# EAGLE design V2_Flight_Controller (EAGLE 9.5.1)
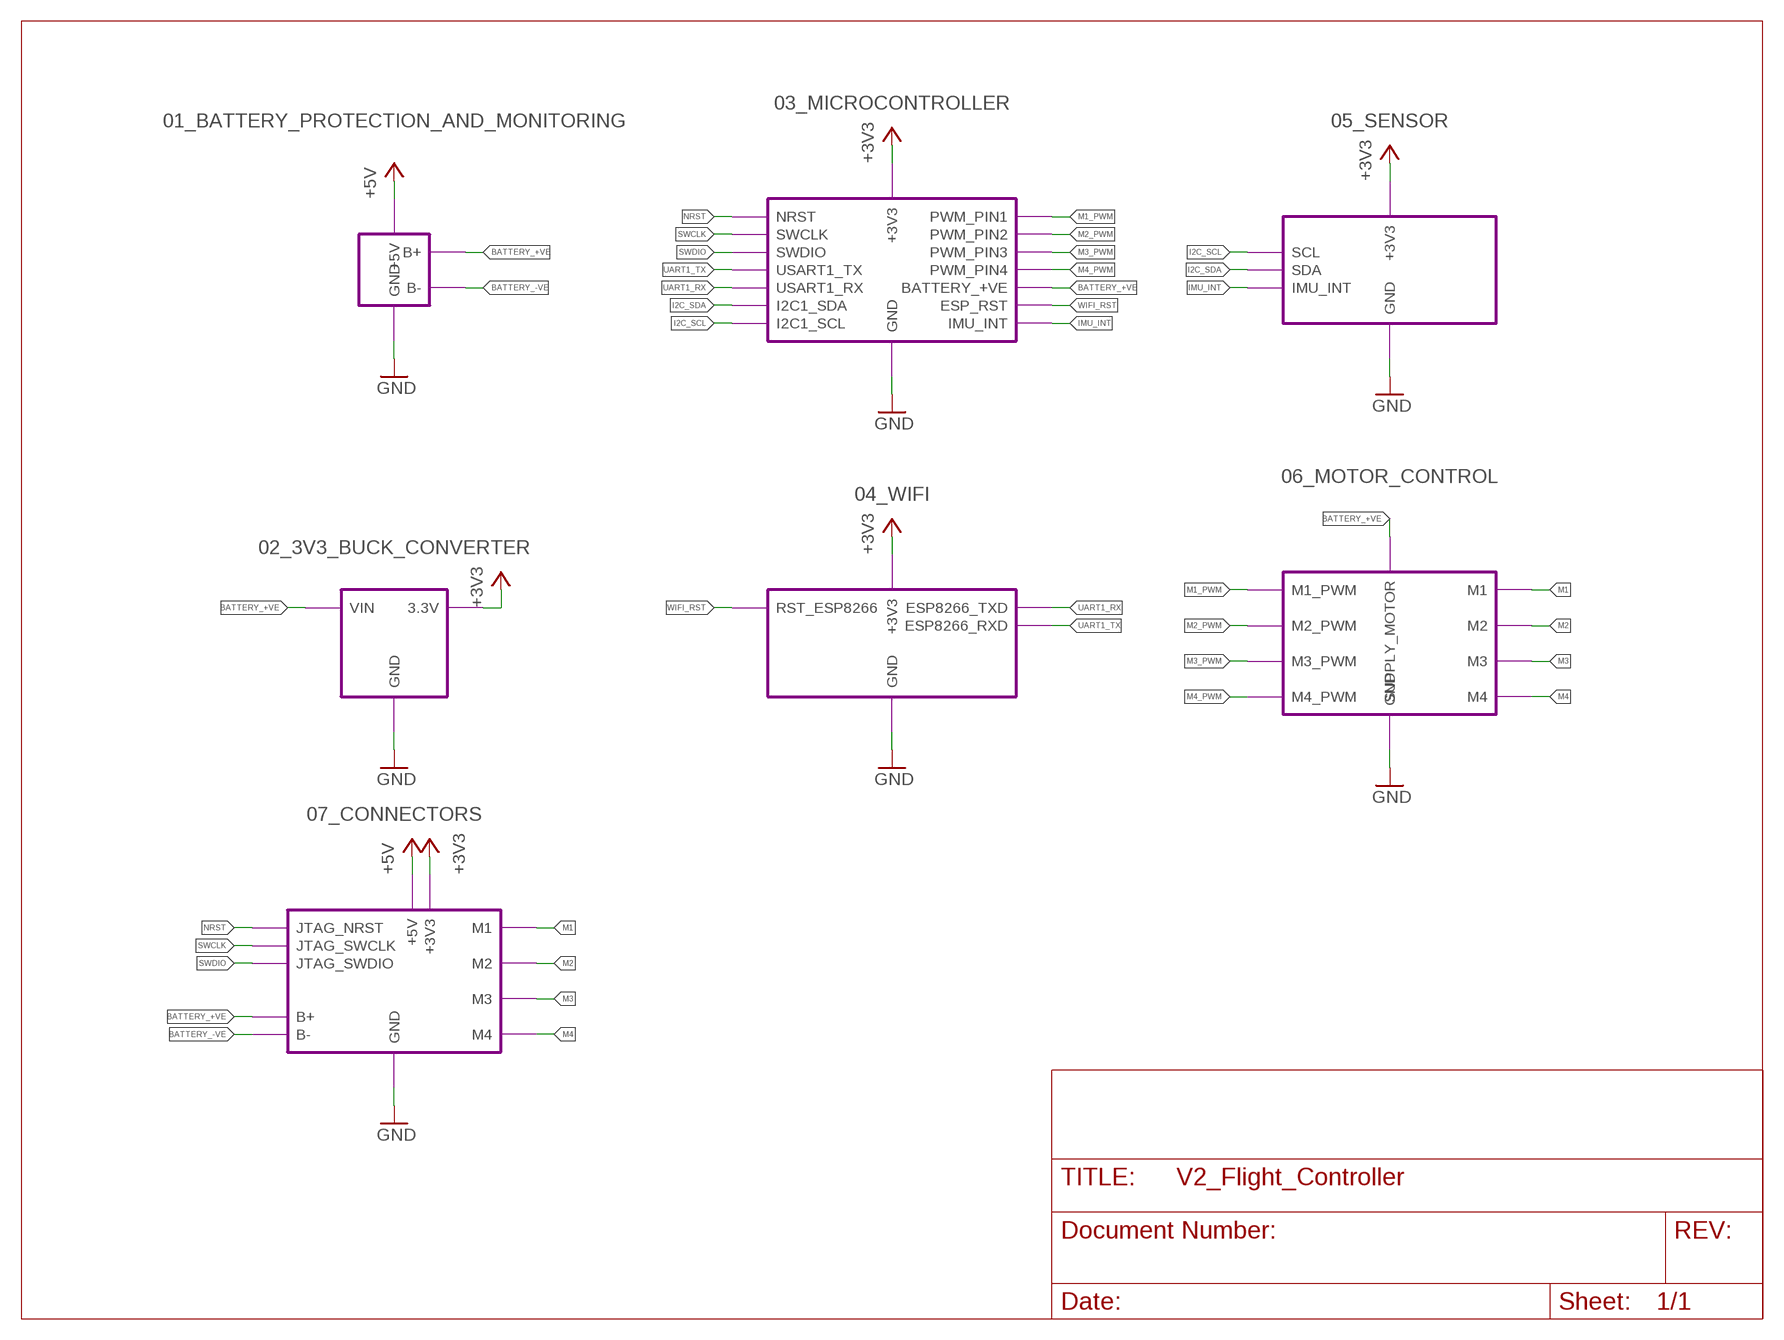
[diagram p0: schematic, sheet 1]

## Module instances
03_MICROCONTROLLER = MICROCONTROLLER
02_3V3_BUCK_CONVERTER = 3V3_BUCK_CONVERTER
01_BATTERY_PROTECTION_AND_MONITORING = BATTERY_PROTECTION_AND_MONITORING
04_WIFI = WIFI
05_SENSOR = SENSOR
06_MOTOR_CONTROL = MOTOR_CONTROL
07_CONNECTORS = CONNECTORS

## Nets
+3V3: port 07_CONNECTORS.+3V3 02_3V3_BUCK_CONVERTER.3.3V 04_WIFI.+3V3 03_MICROCONTROLLER.+3V3 05_SENSOR.+3V3
+5V: port 01_BATTERY_PROTECTION_AND_MONITORING.+5V 07_CONNECTORS.+5V
BATTERY_+VE: port 01_BATTERY_PROTECTION_AND_MONITORING.B+ 07_CONNECTORS.B+ 02_3V3_BUCK_CONVERTER.VIN 06_MOTOR_CONTROL.SUPPLY_MOTOR 03_MICROCONTROLLER.BATTERY_+VE
BATTERY_-VE: port 01_BATTERY_PROTECTION_AND_MONITORING.B- 07_CONNECTORS.B-
GND: port 01_BATTERY_PROTECTION_AND_MONITORING.GND 02_3V3_BUCK_CONVERTER.GND 04_WIFI.GND 06_MOTOR_CONTROL.GND 05_SENSOR.GND 03_MICROCONTROLLER.GND 07_CONNECTORS.GND
I2C_SCL: port 03_MICROCONTROLLER.I2C1_SCL 05_SENSOR.SCL
I2C_SDA: port 03_MICROCONTROLLER.I2C1_SDA 05_SENSOR.SDA
IMU_INT: port 03_MICROCONTROLLER.IMU_INT 05_SENSOR.IMU_INT
M1: port 07_CONNECTORS.M1 06_MOTOR_CONTROL.M1
M1_PWM: port 06_MOTOR_CONTROL.M1_PWM 03_MICROCONTROLLER.PWM_PIN1
M2: port 07_CONNECTORS.M2 06_MOTOR_CONTROL.M2
M2_PWM: port 03_MICROCONTROLLER.PWM_PIN2 06_MOTOR_CONTROL.M2_PWM
M3: port 07_CONNECTORS.M3 06_MOTOR_CONTROL.M3
M3_PWM: port 03_MICROCONTROLLER.PWM_PIN3 06_MOTOR_CONTROL.M3_PWM
M4: port 07_CONNECTORS.M4 06_MOTOR_CONTROL.M4
M4_PWM: port 03_MICROCONTROLLER.PWM_PIN4 06_MOTOR_CONTROL.M4_PWM
NRST: port 03_MICROCONTROLLER.NRST 07_CONNECTORS.JTAG_NRST
SWCLK: port 03_MICROCONTROLLER.SWCLK 07_CONNECTORS.JTAG_SWCLK
SWDIO: port 03_MICROCONTROLLER.SWDIO 07_CONNECTORS.JTAG_SWDIO
UART1_RX: port 03_MICROCONTROLLER.USART1_RX 04_WIFI.ESP8266_TXD
UART1_TX: port 03_MICROCONTROLLER.USART1_TX 04_WIFI.ESP8266_RXD
WIFI_RST: port 04_WIFI.RST_ESP8266 03_MICROCONTROLLER.ESP_RST

## Library data of the parts

## Module MICROCONTROLLER
Ports: PWM_PIN1(out) PWM_PIN2(out) PWM_PIN3(out) PWM_PIN4(out) NRST(io) SWCLK(io) SWDIO(io) I2C1_SCL(io) I2C1_SDA(io) USART1_TX(out) USART1_RX(io) IMU_INT(io) +3V3(pwr) GND(pwr) BATTERY_+VE(in) ESP_RST(out)
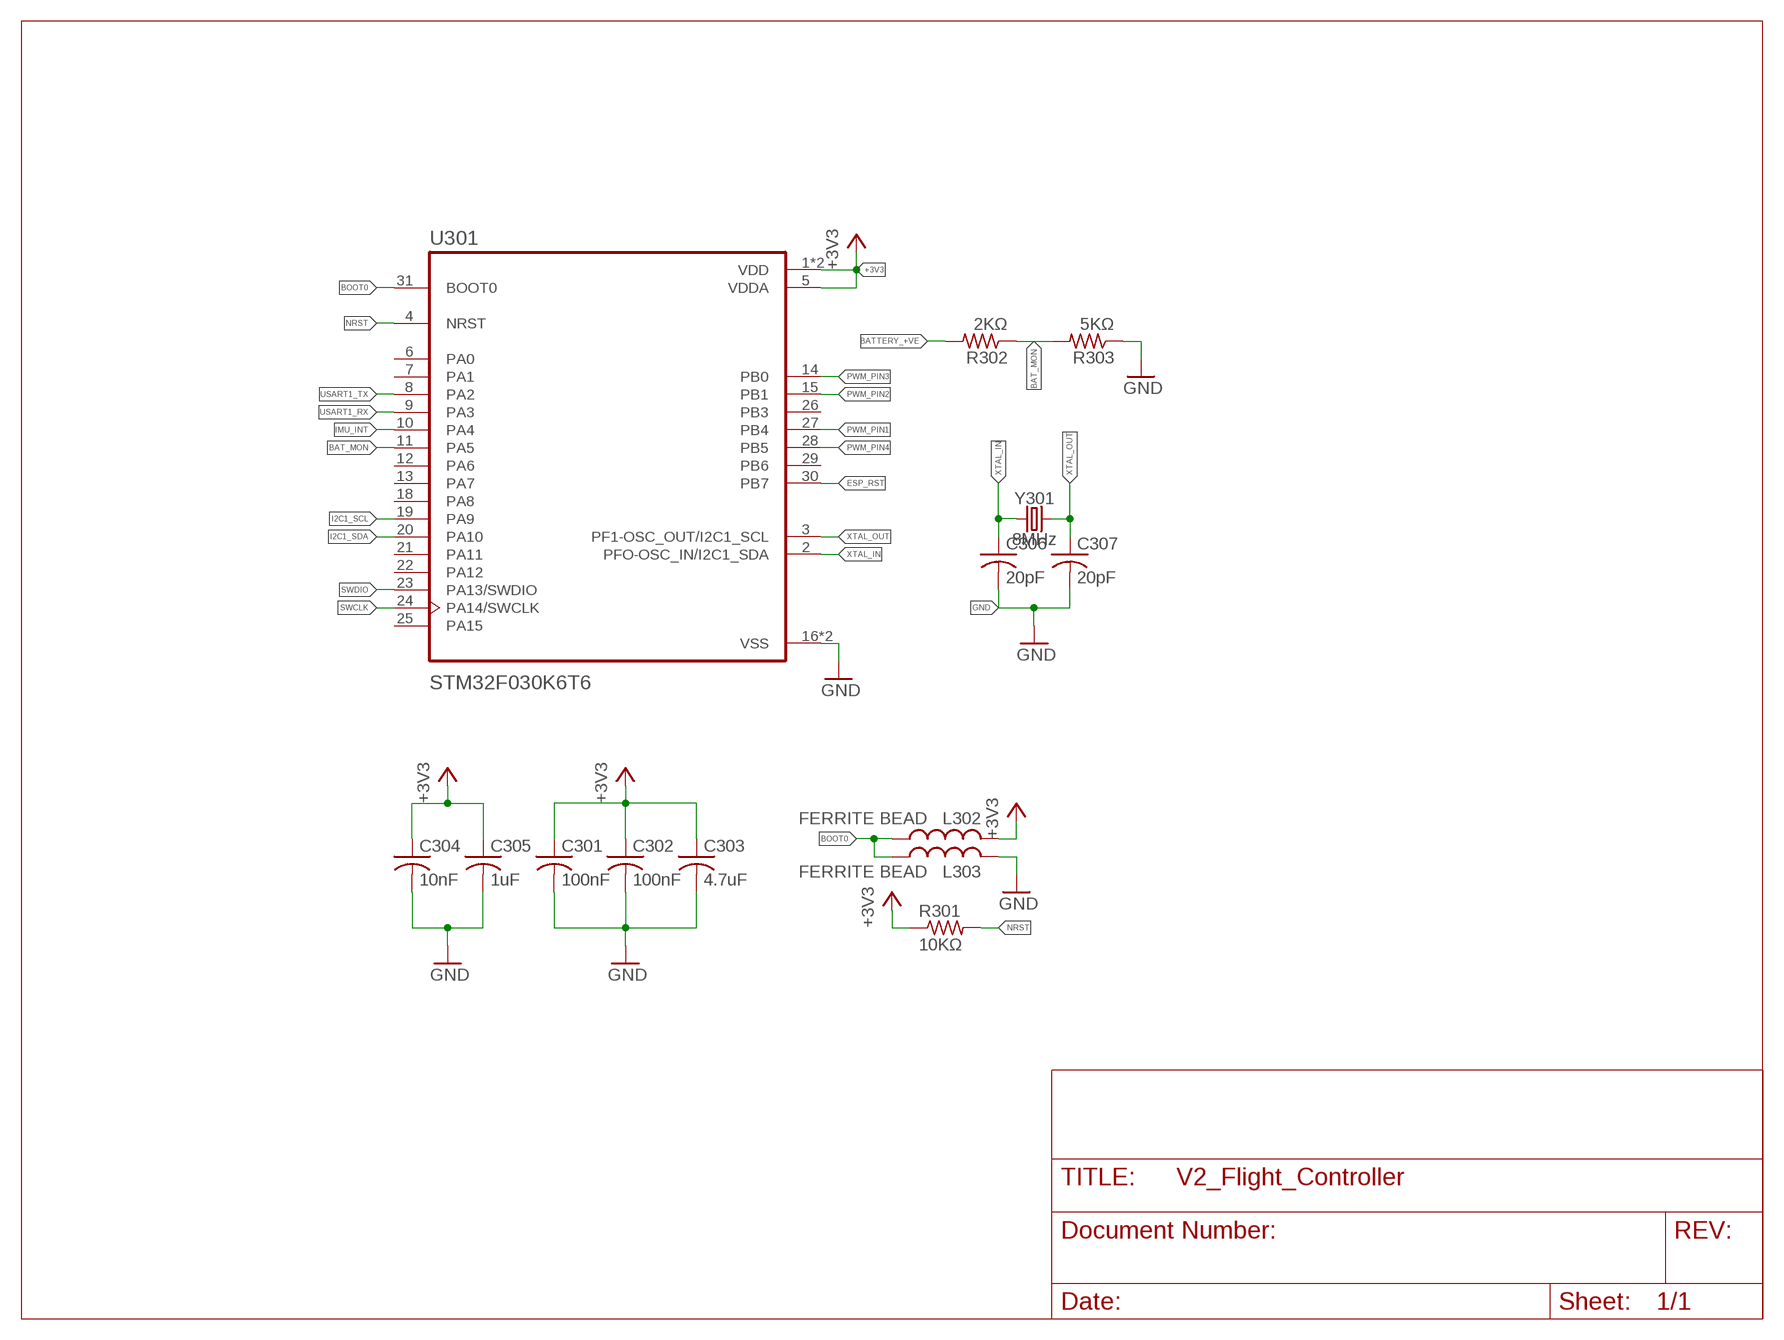
[diagram p1: schematic, module MICROCONTROLLER, sheet 1]

### Parts
C301  100nF  C-USC0603  [C0603]
C302  100nF  C-USC0603  [C0603]
C303  4.7uF  C-USC0603  [C0603]
C304  10nF  C-USC0603  [C0603]
C305  1uF  C-USC0603  [C0603]
C306  20pF  C-USC0603  [C0603]
C307  20pF  C-USC0603  [C0603]
L302  FERRITE BEAD  L-USL2012C  [L2012C]
L303  FERRITE BEAD  L-USL2012C  [L2012C]
R301  10KΩ  R-US_R0603  [R0603]
R302  2KΩ  R-US_R0603  [R0603]
R303  5KΩ  R-US_R0603  [R0603]
U301  STM32F030K6T6  [QFP80P900X900X160-32N]
Y301  8MHz  CRYSTAL-8MHZSMD-HC49UP  [HC49UP]

### Nets
+3V3: C301.1 C302.1 C303.1 C304.1 C305.1 L302.2 R301.1 U301.1(VDD) U301.5(VDDA) U301.17(VDD)
BAT_MON: R302.1 R303.2 U301.11(PA5)
BATTERY_+VE: R302.2
BOOT0: L302.1 L303.1 U301.31(BOOT0)
ESP_RST: U301.30(PB7)
GND: C301.2 C302.2 C303.2 C304.2 C305.2 C306.2 C307.2 L303.2 R303.1 U301.16(VSS) U301.32(VSS)
I2C1_SCL: U301.19(PA9)
I2C1_SDA: U301.20(PA10)
IMU_INT: U301.10(PA4)
NRST: R301.2 U301.4(NRST)
PWM_PIN1: U301.27(PB4)
PWM_PIN2: U301.15(PB1)
PWM_PIN3: U301.14(PB0)
PWM_PIN4: U301.28(PB5)
SWCLK: U301.24(PA14/SWCLK)
SWDIO: U301.23(PA13/SWDIO)
USART1_RX: U301.9(PA3)
USART1_TX: U301.8(PA2)
XTAL_IN: C306.1 U301.2(PFO-OSC_IN/I2C1_SDA) Y301.1
XTAL_OUT: C307.1 U301.3(PF1-OSC_OUT/I2C1_SCL) Y301.2
Unconnected: U301.6(PA0) U301.7(PA1) U301.12(PA6) U301.13(PA7) U301.18(PA8) U301.21(PA11) U301.22(PA12) U301.25(PA15) U301.26(PB3) U301.29(PB6)

### Library data of the parts
C301-C307 = adafruit:C-US: CAPACITOR, American symbol
L302 L303 = rcl:L-US: INDUCTOR, American symbol; SPICEPREFIX: L
R301-R303 = adafruit:R-US_: RESISTOR, American symbol
U301 = STM32F030K6T6:STM32F030K6T6: None; AVAILABILITY: Unavailable; DESCRIPTION: MCU 32-Bit STM32F ARM Cortex M0 RISC 32KB Flash 2.5V/3.3V 32-Pin LQFP Tray; MF: STMicroelectronics; MP: STM32F030K6T6; PACKAGE: LQFP-32 STMicroelectronics; PRICE: None
Y301 = SparkFun-Clocks:CRYSTAL-8MHZ: 8MHz Crystal Datasheet Example <http://www.futureelectronics.com/en/technologies/electromechanical/timing-devices/crystals/Pages/6008189-ABM3B-8.000MHZ-B2-T.aspx?IM=0> Frequency: 8MHz Frequency Tolerance: ±20ppm Load Capacitance: 18pF SparkFun Products: Pro Micro -3.3V/8MHz <https://www.sparkfun.com/products/12587> WAV Trigger <https://www.sparkfun.com/products/13660>; PROD_ID: XTAL-11706

## Module 3V3_BUCK_CONVERTER
Ports: VIN(pwr) 3.3V(pwr) GND(pwr)
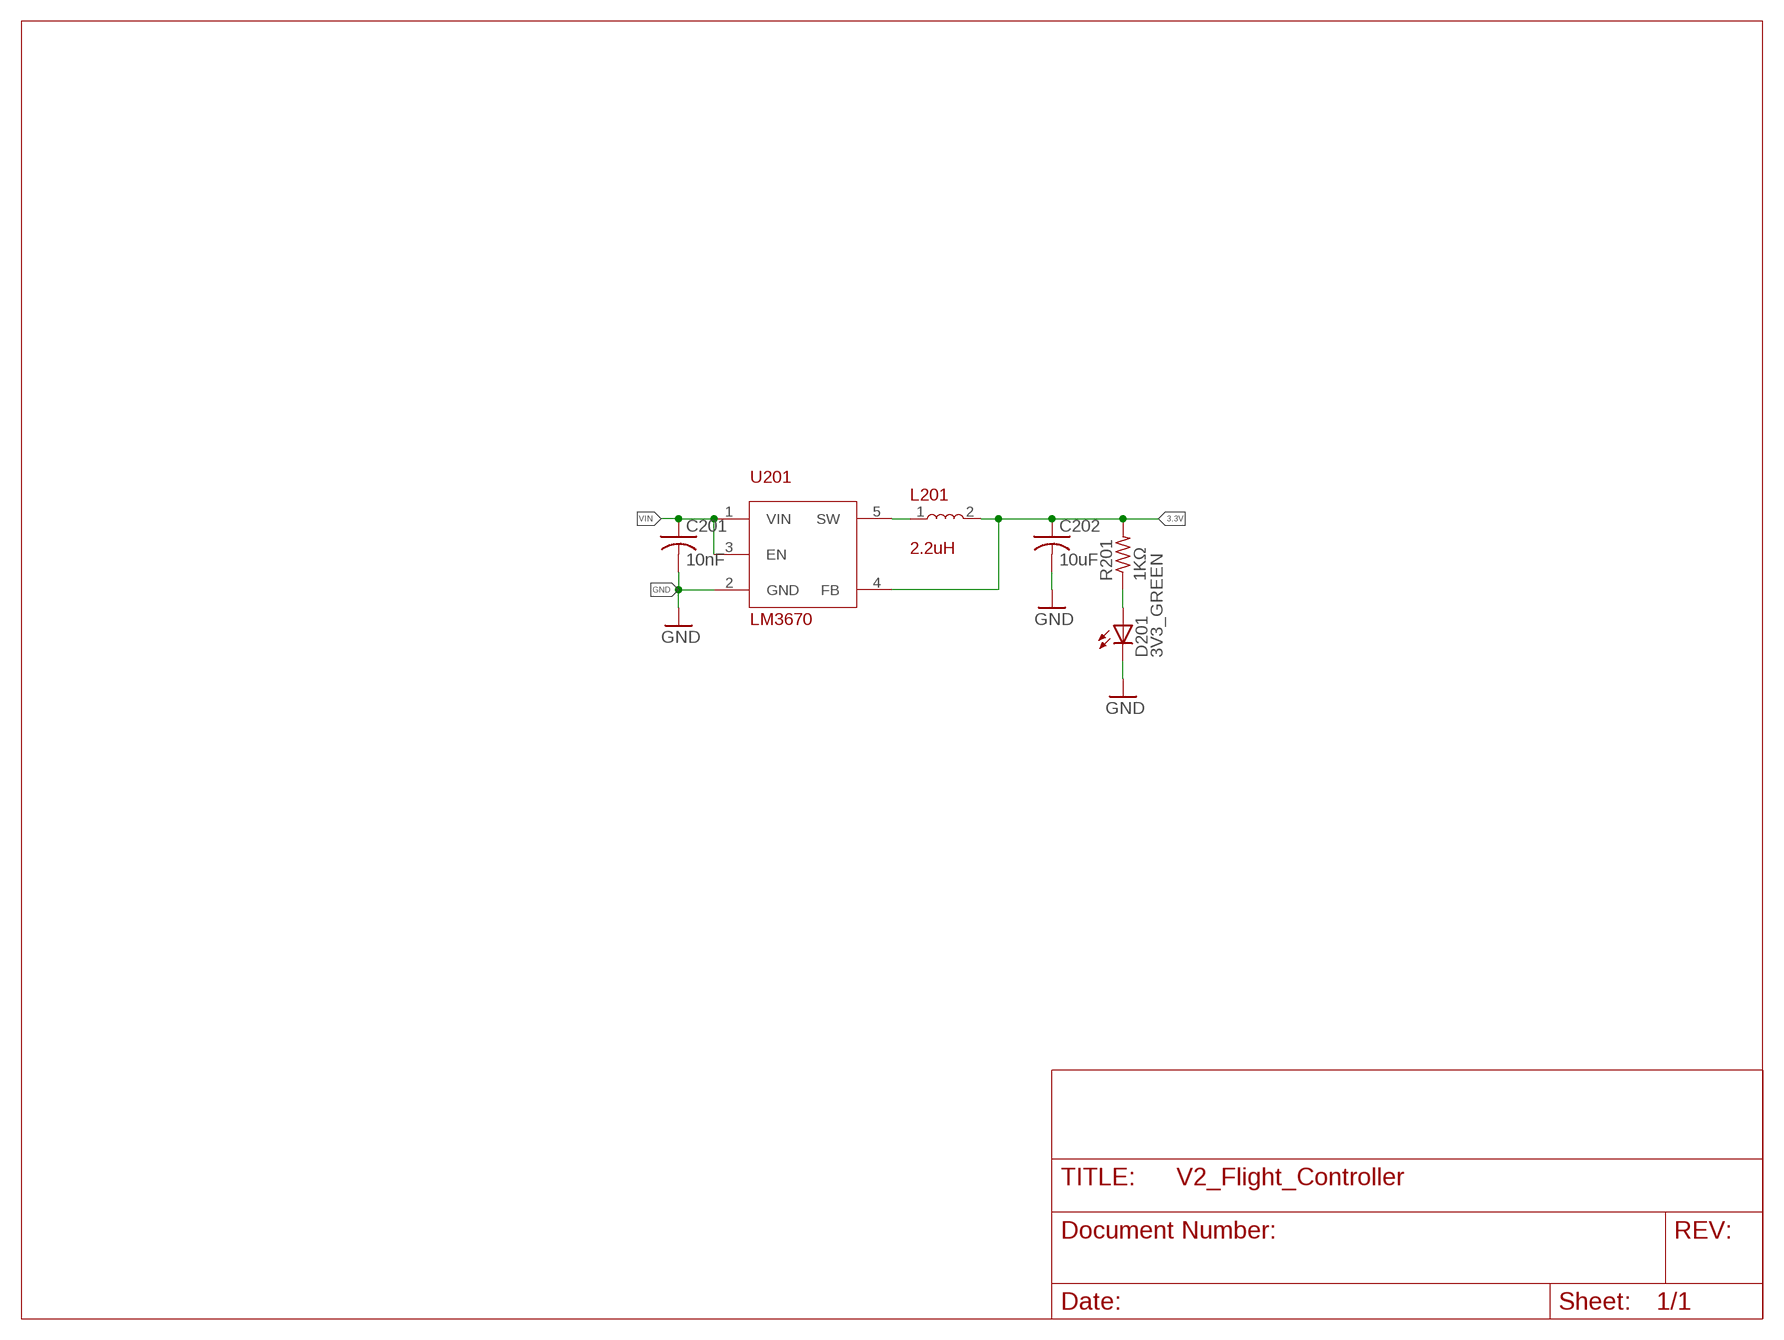
[diagram p2: schematic, module 3V3_BUCK_CONVERTER, sheet 1]

### Parts
C201  10nF  C-USC0603  [C0603]
C202  10uF  C-USC0603  [C0603]
D201  3V3_GREEN  LEDCHIPLED_0603  [CHIPLED_0603]
L201  2.2uH  SRN2009T-2R2M  [SRN2009T-2R2M]
R201  1KΩ  R-US_R0603  [R0603]
U201  LM3670  [SOT-23-5]

### Nets
3.3V: C202.1 L201.2 R201.2 U201.4(FB)
GND: C201.2 C202.2 D201.C U201.2(GND)
LED_3V3: D201.A R201.1
SW: L201.1 U201.5(SW)
VIN: C201.1 U201.1(VIN) U201.3(EN)

### Library data of the parts
C201 C202 = adafruit:C-US: CAPACITOR, American symbol
D201 = adafruit:LED: LED OSRAM: - CHIPLED LG R971, LG N971, LY N971, LG Q971, LY Q971, LO R971, LY R971 LH N974, LH R974 LS Q976, LO Q976, LY Q976 LO Q996 - Hyper CHIPLED LW Q18S LB Q993, LB Q99A, LB R99A - SideLED LS A670, LO A670, LY A670, LG A670, LP A670 LB A673, LV A673, LT A673, LW A673 LH A674 LY A675 LS A676, LA A676, LO A676, LY A676, LW A676 LS A679, LY A679, LG A679 - Hyper Micro SIDELED® LS Y876, LA Y876, LO Y876, LY Y876 LT Y87S - SmartLED LW L88C, LW L88S LB L89C, LB L89S, LG L890 LS L89K, LO L89K, LY L89K LS L896, LA L896, LO L896, LY L896 - TOPLED LS T670, LO T670, LY T670, LG T670, LP T670 LSG T670, LSP T670, LSY T670, LOP T670, LYG T670 LG T671, LOG T671, LSG T671 LB T673, LV T673, LT T673, LW T673 LH T674 LS T676, LA T676, LO T676, LY T676, LB T676, LH T676, LSB T676, LW T676 LB T67C, LV T67C, LT T67C, LS T67K, LO T67K, LY T67K, LW E67C LS E67B, LA E67B, LO E67B, LY E67B, LB E67C, LV E67C, LT E67C LW T67C LS T679, LY T679, LG T679 LS T770, LO T770, LY T770, LG T770, LP T770 LB T773, LV T773, LT T773, LW T773 LH T774 LS E675, LA E675, LY E675, LS T675 LS T776, LA T776, LO T776, LY T776, LB T776 LHGB T686 LT T68C, LB T68C - Hyper Mini TOPLED® LB M676 - Mini TOPLED Santana® LG M470 LS M47K, LO M47K, LY M47K Source: http://www.osram.convergy.de/
L201 = SRN2009T-2R2M:SRN2009T-2R2M
R201 = adafruit:R-US_: RESISTOR, American symbol
U201 = smd-footprints:LM3670

## Module BATTERY_PROTECTION_AND_MONITORING
Ports: GND(pwr) B+(io) B-(io) +5V(pwr)
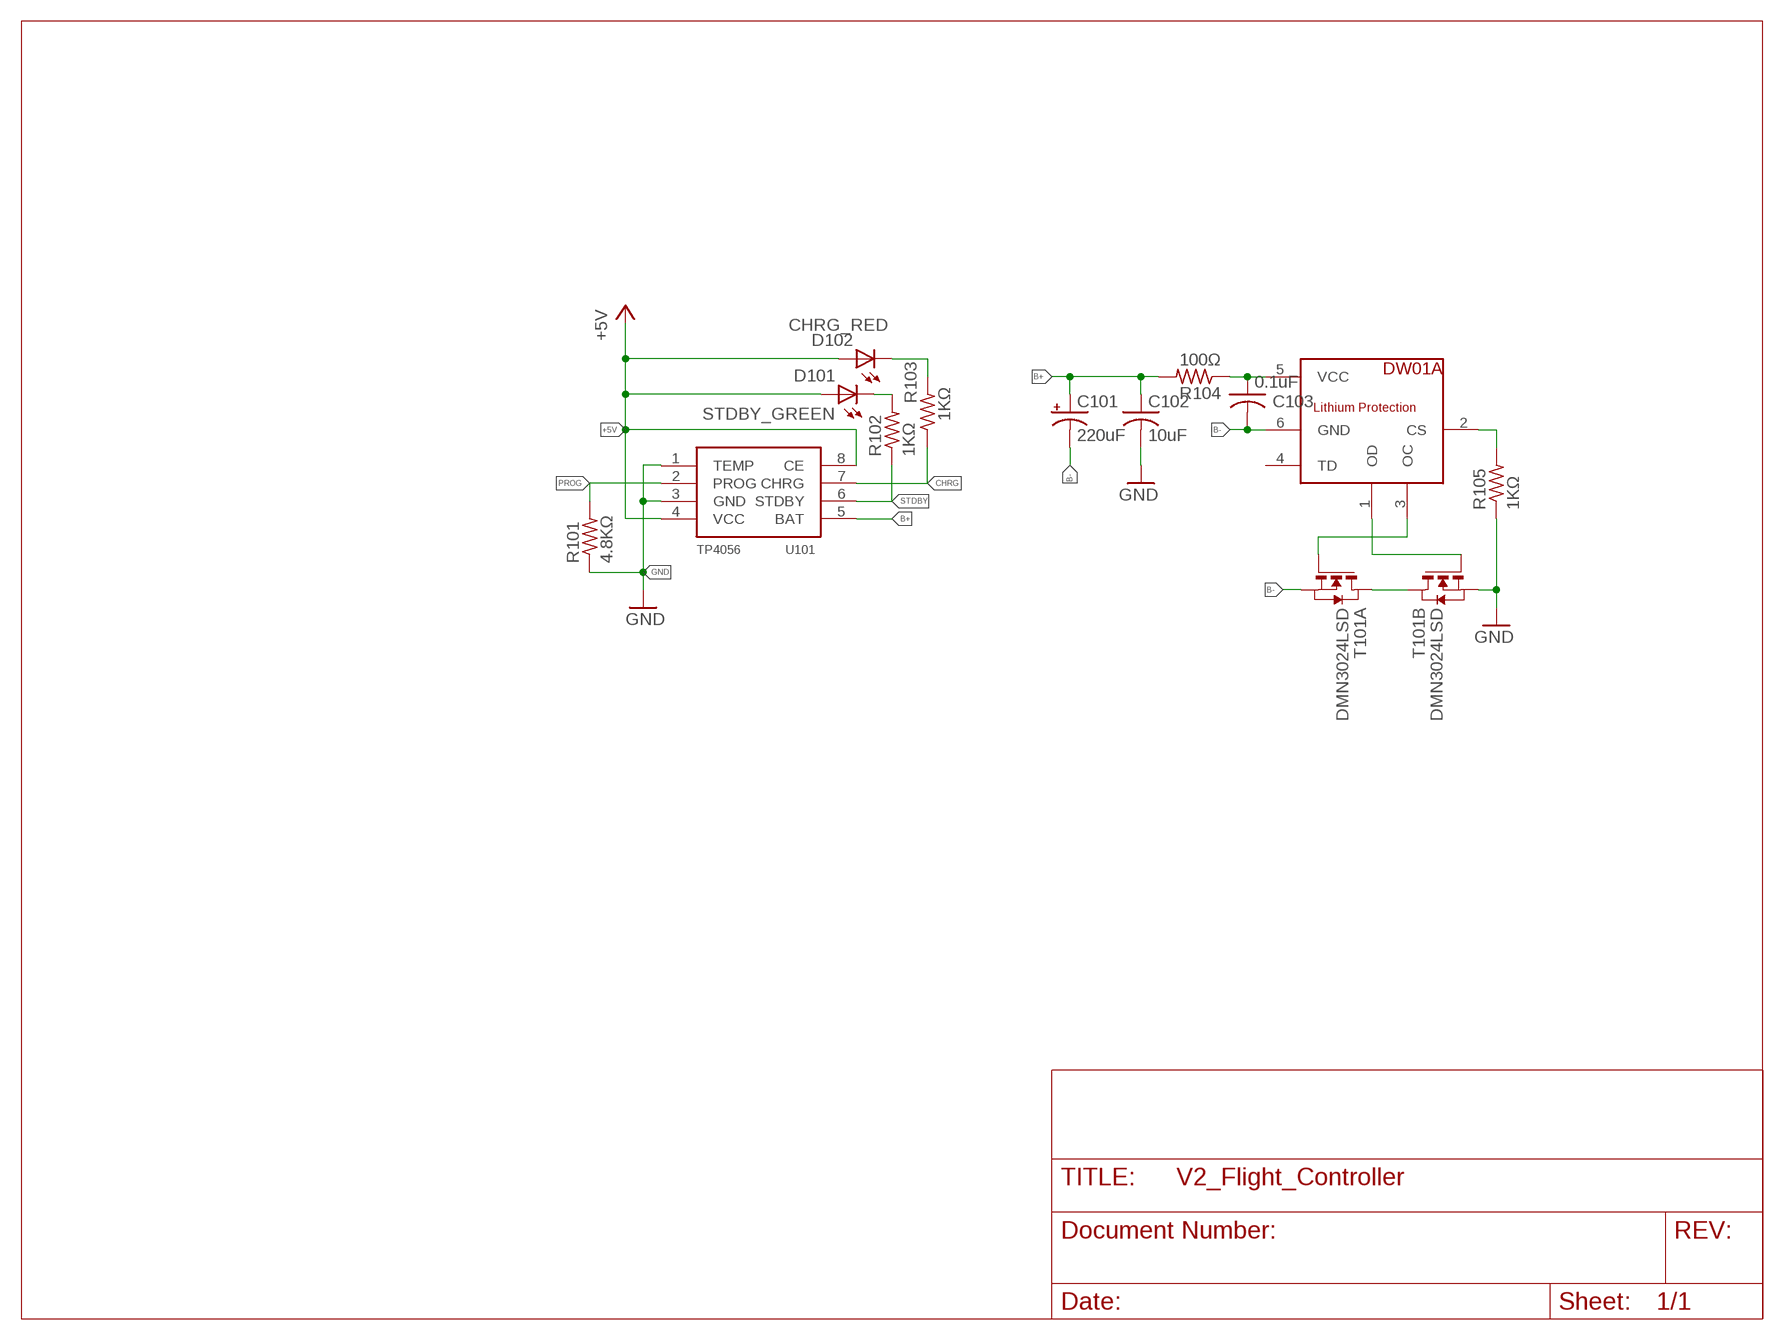
[diagram p3: schematic, module BATTERY_PROTECTION_AND_MONITORING, sheet 1]

### Parts
C101  220uF  CPOL-USE  [PANASONIC_E]
C102  10uF  C-USC0603  [C0603]
C103  0.1uF  C-USC0603  [C0603]
D101  STDBY_GREEN  LEDCHIPLED_0603  [CHIPLED_0603]
D102  CHRG_RED  LEDCHIPLED_0603  [CHIPLED_0603]
R101  4.8KΩ  R-US_R0603  [R0603]
R102  1KΩ  R-US_R0603  [R0603]
R103  1KΩ  R-US_R0603  [R0603]
R104  100Ω  R-US_R0603  [R0603]
R105  1KΩ  R-US_R0603  [R0603]
T101  DMN3024LSD  [TSSOP-8]
U101  TP4056  [SOP-8]
U102  DW01A  [SOT23-6]

### Nets
+5V: D101.A D102.A U101.4(VCC) U101.8(CE)
B+: C101.+ C102.1 R104.2 U101.5(BAT)
B-: C101.- C103.2 T101.2(A:S) T101.3(A:S) U102.6(GND)
CHRG: R103.1 U101.7(CHRG)
CHRG_LED: D102.C R103.2
CS: R105.2 U102.2(CS)
D2S: T101.1(A:D) T101.8(B:D)
GND: C102.2 R101.1 R105.1 T101.6(B:S) T101.7(B:S) U101.1(TEMP) U101.3(GND)
OC: T101.4(A:G) U102.3(OC)
OD: T101.5(B:G) U102.1(OD)
PROG: R101.2 U101.2(PROG)
STDBY: R102.1 U101.6(STDBY)
STDBY_LED: D101.C R102.2
VCC: C103.1 R104.1 U102.5(VCC)
Unconnected: U102.4(TD)

### Library data of the parts
C101 = adafruit:CPOL-US: POLARIZED CAPACITOR, American symbol
C102 C103 = adafruit:C-US: CAPACITOR, American symbol
D101 D102 = adafruit:LED: LED OSRAM: - CHIPLED LG R971, LG N971, LY N971, LG Q971, LY Q971, LO R971, LY R971 LH N974, LH R974 LS Q976, LO Q976, LY Q976 LO Q996 - Hyper CHIPLED LW Q18S LB Q993, LB Q99A, LB R99A - SideLED LS A670, LO A670, LY A670, LG A670, LP A670 LB A673, LV A673, LT A673, LW A673 LH A674 LY A675 LS A676, LA A676, LO A676, LY A676, LW A676 LS A679, LY A679, LG A679 - Hyper Micro SIDELED® LS Y876, LA Y876, LO Y876, LY Y876 LT Y87S - SmartLED LW L88C, LW L88S LB L89C, LB L89S, LG L890 LS L89K, LO L89K, LY L89K LS L896, LA L896, LO L896, LY L896 - TOPLED LS T670, LO T670, LY T670, LG T670, LP T670 LSG T670, LSP T670, LSY T670, LOP T670, LYG T670 LG T671, LOG T671, LSG T671 LB T673, LV T673, LT T673, LW T673 LH T674 LS T676, LA T676, LO T676, LY T676, LB T676, LH T676, LSB T676, LW T676 LB T67C, LV T67C, LT T67C, LS T67K, LO T67K, LY T67K, LW E67C LS E67B, LA E67B, LO E67B, LY E67B, LB E67C, LV E67C, LT E67C LW T67C LS T679, LY T679, LG T679 LS T770, LO T770, LY T770, LG T770, LP T770 LB T773, LV T773, LT T773, LW T773 LH T774 LS E675, LA E675, LY E675, LS T675 LS T776, LA T776, LO T776, LY T776, LB T776 LHGB T686 LT T68C, LB T68C - Hyper Mini TOPLED® LB M676 - Mini TOPLED Santana® LG M470 LS M47K, LO M47K, LY M47K Source: http://www.osram.convergy.de/
R101-R105 = adafruit:R-US_: RESISTOR, American symbol
T101 = FS8205A:DMN3024LSD: DUAL N-CHANNEL ENHANCEMENT MODE MOSFET data sheet <http://goo.gl/dRgboR> Dave.Calaway Eagle Library <https://goo.gl/Muy1Tr>
U101 = tp4056:TP4056
U102 = dw01a:DW01A

## Module WIFI
Ports: ESP8266_TXD(out) ESP8266_RXD(in) +3V3(pwr) GND(pwr) RST_ESP8266(io)
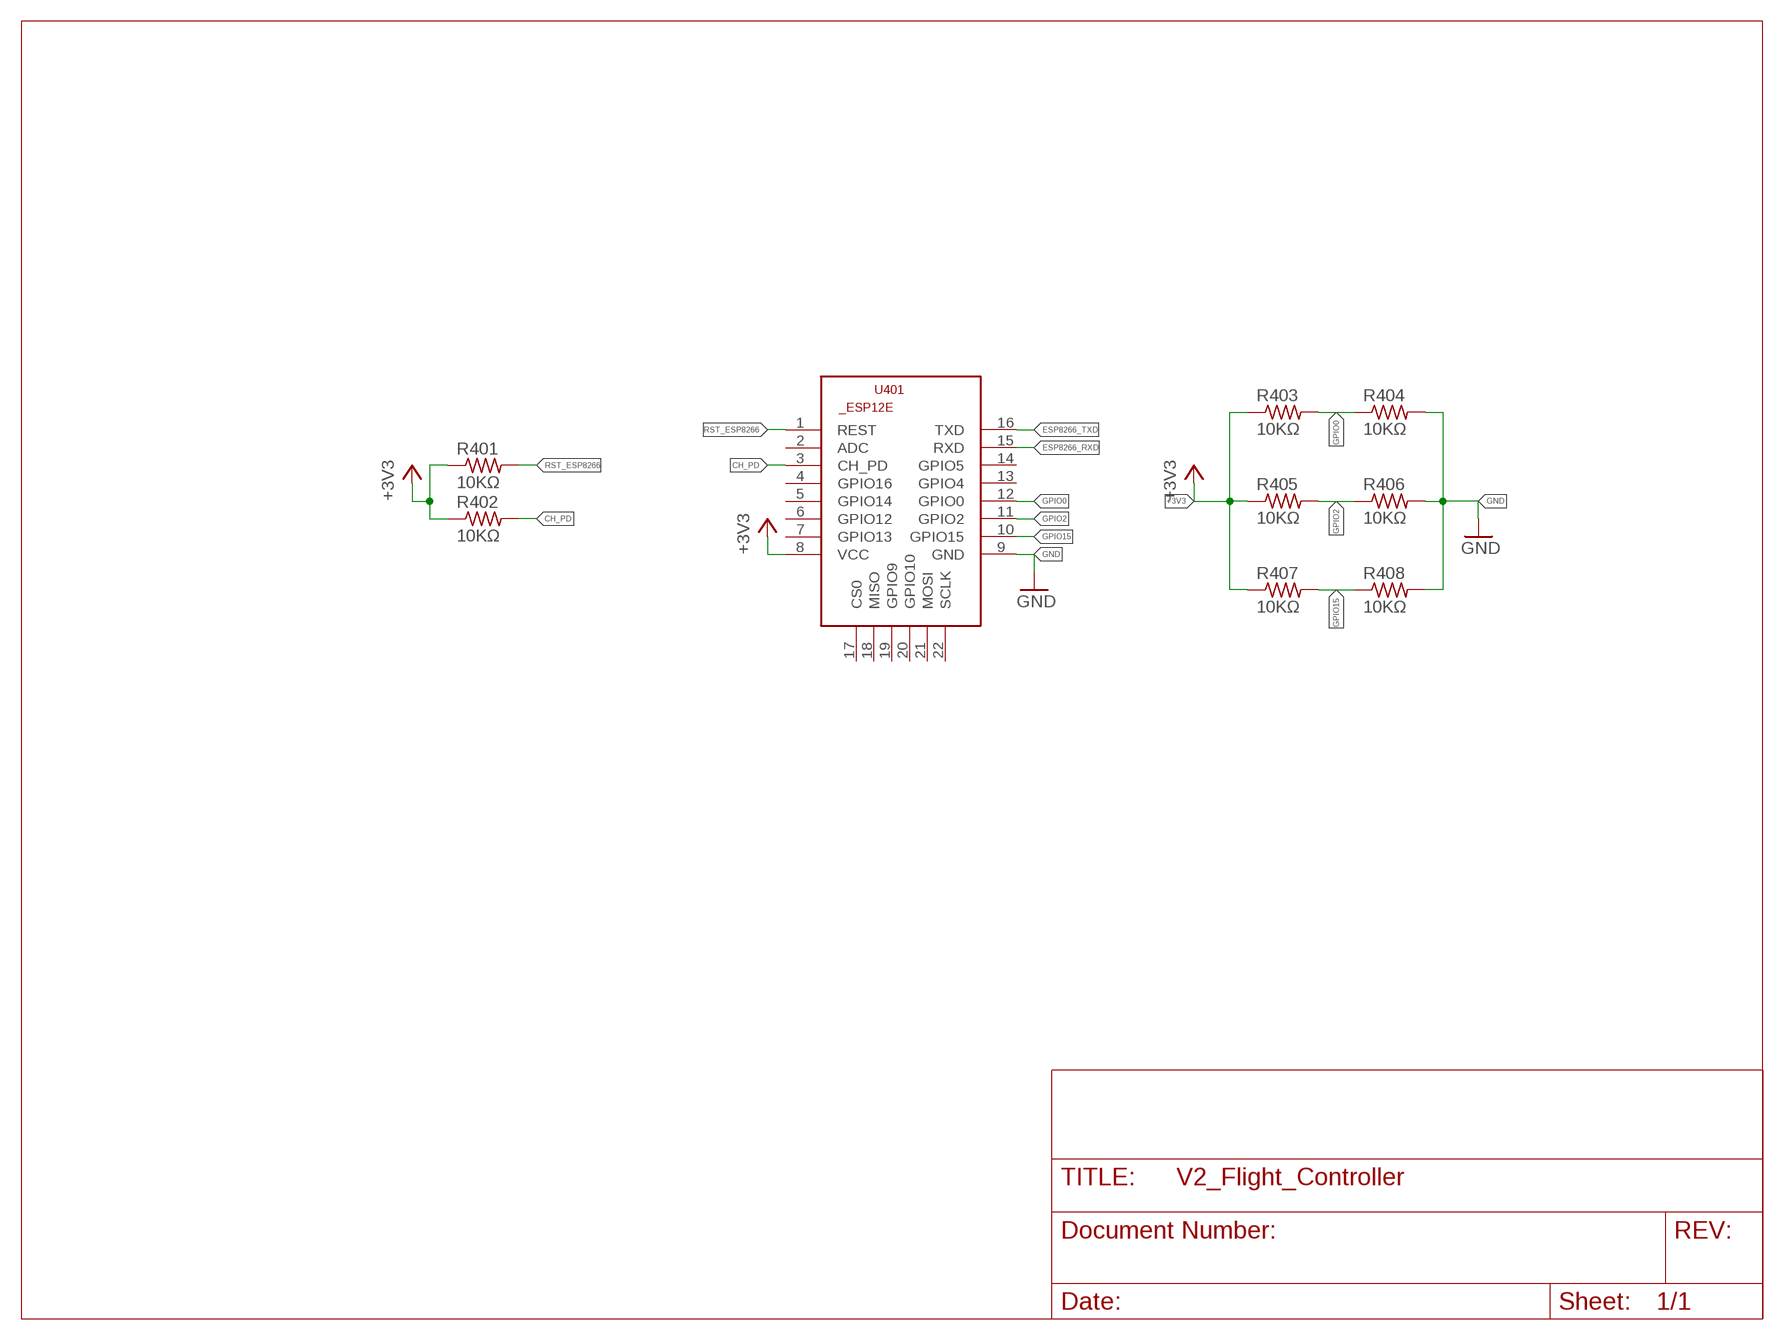
[diagram p4: schematic, module WIFI, sheet 1]

### Parts
R401  10KΩ  R-US_R0603  [R0603]
R402  10KΩ  R-US_R0603  [R0603]
R403  10KΩ  R-US_R0603  [R0603]
R404  10KΩ  R-US_R0603  [R0603]
R405  10KΩ  R-US_R0603  [R0603]
R406  10KΩ  R-US_R0603  [R0603]
R407  10KΩ  R-US_R0603  [R0603]
R408  10KΩ  R-US_R0603  [R0603]
U401  WIFI_MODULE  ESP8266-12EESP12E  [ESP8266-ESP12E]

### Nets
+3V3: R401.1 R402.1 R403.1 R405.1 R407.1 U401.8(VCC)
CH_PD: R402.2 U401.3(CH_PD)
ESP8266_RXD: U401.15(RXD)
ESP8266_TXD: U401.16(TXD)
GND: R404.2 R406.2 R408.2 U401.9(GND)
GPIO0: R403.2 R404.1 U401.12(GPIO0)
GPIO2: R405.2 R406.1 U401.11(GPIO2)
GPIO15: R407.2 R408.1 U401.10(GPIO15)
RST_ESP8266: R401.2 U401.1(REST)
Unconnected: U401.2(ADC) U401.4(GPIO16) U401.5(GPIO14) U401.6(GPIO12) U401.7(GPIO13) U401.13(GPIO4) U401.14(GPIO5) U401.17(CS0) U401.18(MISO) U401.19(GPIO9) U401.20(GPIO10) U401.21(MOSI) U401.22(SCLK)

### Library data of the parts
R401-R408 = adafruit:R-US_: RESISTOR, American symbol
U401 = esp12e:ESP8266-12E: ESP8266-12E Library for Eagle CAD The author not responsible for any damages or errors!. Created by Suhail jr.lt;/author>

## Module SENSOR
Ports: SCL(io) SDA(io) IMU_INT(out) GND(pwr) +3V3(pwr)
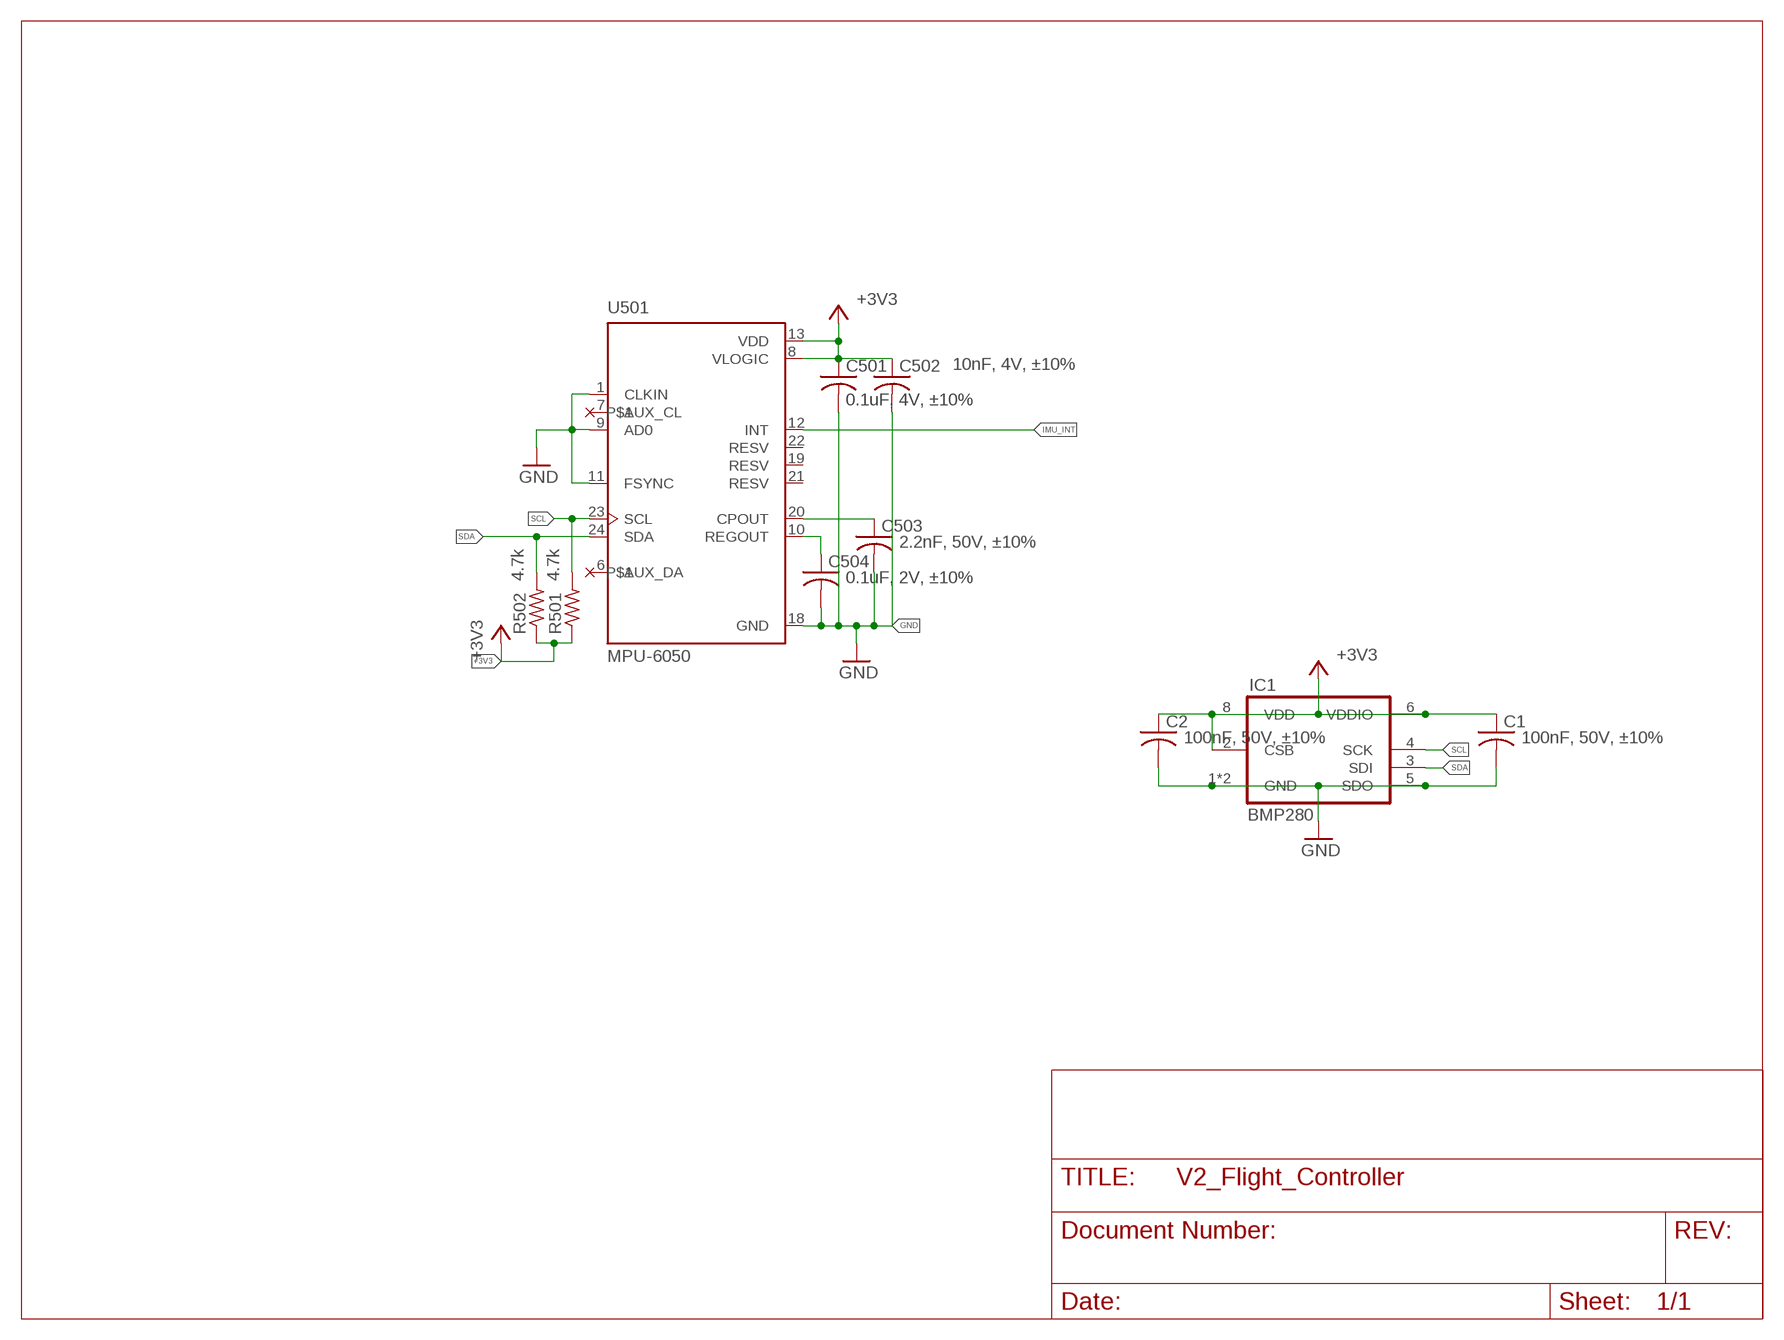
[diagram p5: schematic, module SENSOR, sheet 1]

### Parts
C1  100nF, 50V, ±10%  C-USC0603  [C0603]
C2  100nF, 50V, ±10%  C-USC0603  [C0603]
C501  0.1uF, 4V, ±10%  C-USC0603  [C0603]
C502  10nF, 4V, ±10%  C-USC0603  [C0603]
C503  2.2nF, 50V, ±10%  C-USC0603  [C0603]
C504  0.1uF, 2V, ±10%  C-USC0603  [C0603]
IC1  BMP280  [BMP280]
R501  4.7k  R-US_R0603  [R0603]
R502  4.7k  R-US_R0603  [R0603]
U501  MPU-6050  [QFN50P400X400X95-24N]
U$1  NC  (no package)
U$2  NC  (no package)

### Nets
+3V3: C1.1 C2.1 C501.1 C502.1 IC1.2(CSB) IC1.6(VDDIO) IC1.8(VDD) R501.1 R502.1 U501.8(VLOGIC) U501.13(VDD)
CPOUT: C503.1 U501.20(CPOUT)
GND: C1.2 C2.2 C501.2 C502.2 C503.2 C504.2 IC1.1(GND) IC1.5(SDO) IC1.7(GND) U501.1(CLKIN) U501.9(AD0) U501.11(FSYNC) U501.18(GND)
IMU_INT: U501.12(INT)
N$1: U501.7(AUX_CL) U$1.P$1
N$2: U501.6(AUX_DA) U$2.P$1
REGOUT: C504.1 U501.10(REGOUT)
SCL: IC1.4(SCK) R501.2 U501.23(SCL)
SDA: IC1.3(SDI) R502.2 U501.24(SDA)
Unconnected: U501.19(RESV) U501.21(RESV) U501.22(RESV)

### Library data of the parts
C1 C2 C501-C504 = adafruit:C-US: CAPACITOR, American symbol
IC1 = bosch-bmp280:BMP280: The BMP280 is an absolute barometric pressure sensor especially designed for mobile applications. The sensor module is housed in an extremely compact 8-pin metal-lid LGA package with a footprint of only 2.0 × 2.5 mm2 and 0.95 mm package height. Its small dimensions and its low power consumption of 2.7 μA @1Hz allow the implementation in battery driven devices such as mobile phones, GPS modules or watches. The library has been designed by Richard Magdycz <https://www.facebook.com/groups/eaglecadsoftUK>
R501 R502 = adafruit:R-US_: RESISTOR, American symbol
U501 = MPU-6050:MPU-6050: MPU-6050 Six-Axis (Gyro + Accelerometer) MEMS MotionTracking™ Devices; AVAILABILITY: Unavailable; DESCRIPTION: 3-axis gyroscope, 3-axis accelerometer in a 4x4x0.9 housing; MF: TDK InvenSense; MP: MPU-6050; PACKAGE: QFN-24 InvenSense; PRICE: None
U$1 U$2 = NC:NC

## Module MOTOR_CONTROL
Ports: SUPPLY_MOTOR(in) M1(io) M1_PWM(in) M2_PWM(in) M3_PWM(in) M4_PWM(in) M2(io) M3(io) M4(io) GND(pwr)
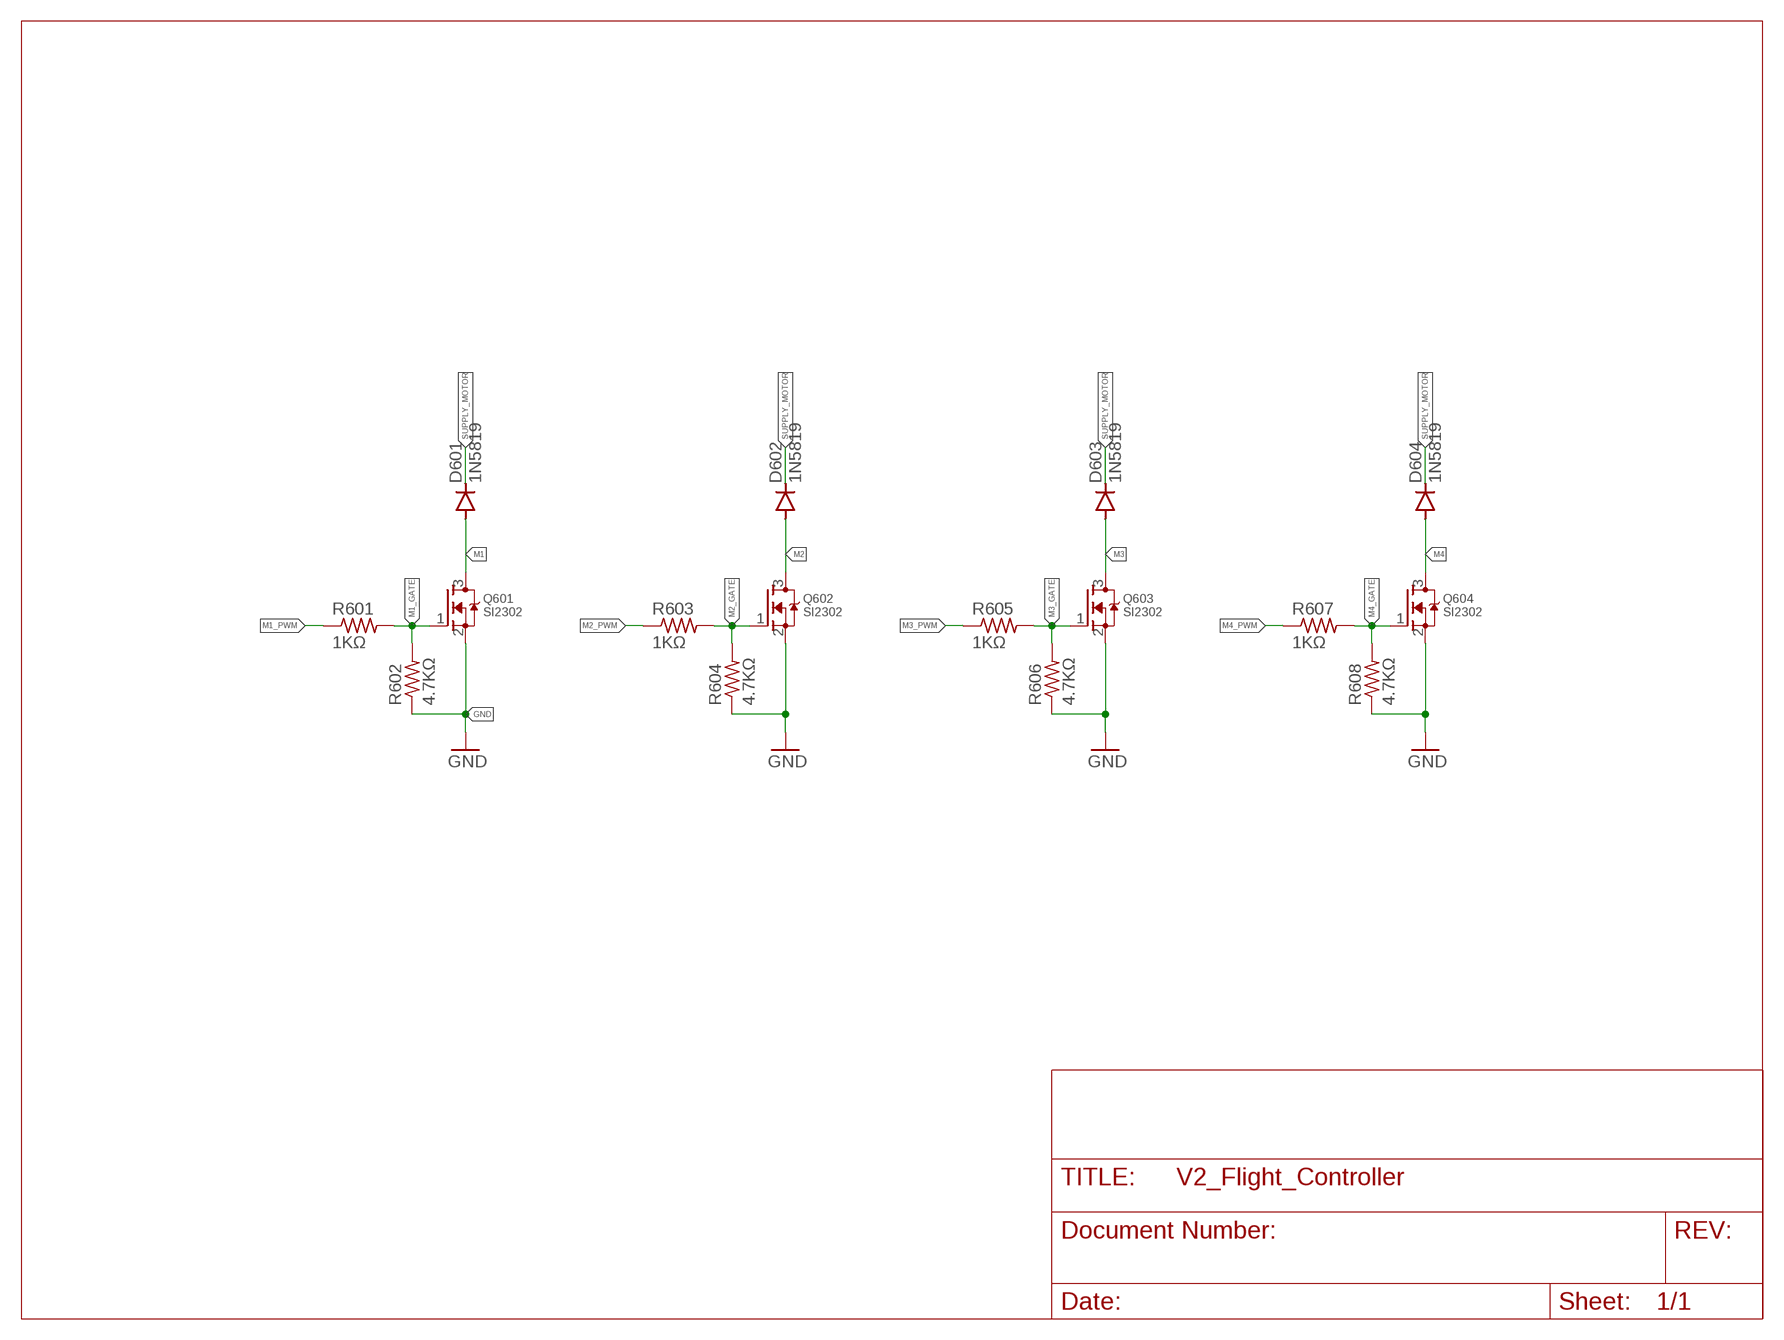
[diagram p6: schematic, module MOTOR_CONTROL, sheet 1]

### Parts
D601  1N5819  DIODE-SOD123  [SOD123]
D602  1N5819  DIODE-SOD123  [SOD123]
D603  1N5819  DIODE-SOD123  [SOD123]
D604  1N5819  DIODE-SOD123  [SOD123]
Q601  SI2302  MOSFET-NREFLOW  [SOT23]
Q602  SI2302  MOSFET-NREFLOW  [SOT23]
Q603  SI2302  MOSFET-NREFLOW  [SOT23]
Q604  SI2302  MOSFET-NREFLOW  [SOT23]
R601  1KΩ  R-US_R0603  [R0603]
R602  4.7KΩ  R-US_R0603  [R0603]
R603  1KΩ  R-US_R0603  [R0603]
R604  4.7KΩ  R-US_R0603  [R0603]
R605  1KΩ  R-US_R0603  [R0603]
R606  4.7KΩ  R-US_R0603  [R0603]
R607  1KΩ  R-US_R0603  [R0603]
R608  4.7KΩ  R-US_R0603  [R0603]

### Nets
GND: Q601.2(S) Q602.2(S) Q603.2(S) Q604.2(S) R602.1 R604.1 R606.1 R608.1
M1: D601.A Q601.3(D)
M1_GATE: Q601.1(G) R601.2 R602.2
M1_PWM: R601.1
M2: D602.A Q602.3(D)
M2_GATE: Q602.1(G) R603.2 R604.2
M2_PWM: R603.1
M3: D603.A Q603.3(D)
M3_GATE: Q603.1(G) R605.2 R606.2
M3_PWM: R605.1
M4: D604.A Q604.3(D)
M4_GATE: Q604.1(G) R607.2 R608.2
M4_PWM: R607.1
SUPPLY_MOTOR: D601.C D602.C D603.C D604.C

### Library data of the parts
D601-D604 = diode:DIODE-: DIODE
Q601-Q604 = adafruit:MOSFET-N: N-Channel Mosfet 2N7002E - 60V 260mA SOT23 [Digikey: 2N7002ET1GOSTR-ND] - REEL BSH103 - 30V 850mA SOT23 [Digikey: 568-5013-1-ND]
R601-R608 = adafruit:R-US_: RESISTOR, American symbol

## Module CONNECTORS
Ports: JTAG_NRST(io) JTAG_SWCLK(io) JTAG_SWDIO(io) +5V(pwr) GND(pwr) B+(out) B-(out) +3V3(pwr) M1(out) M2(out) M3(out) M4(out)
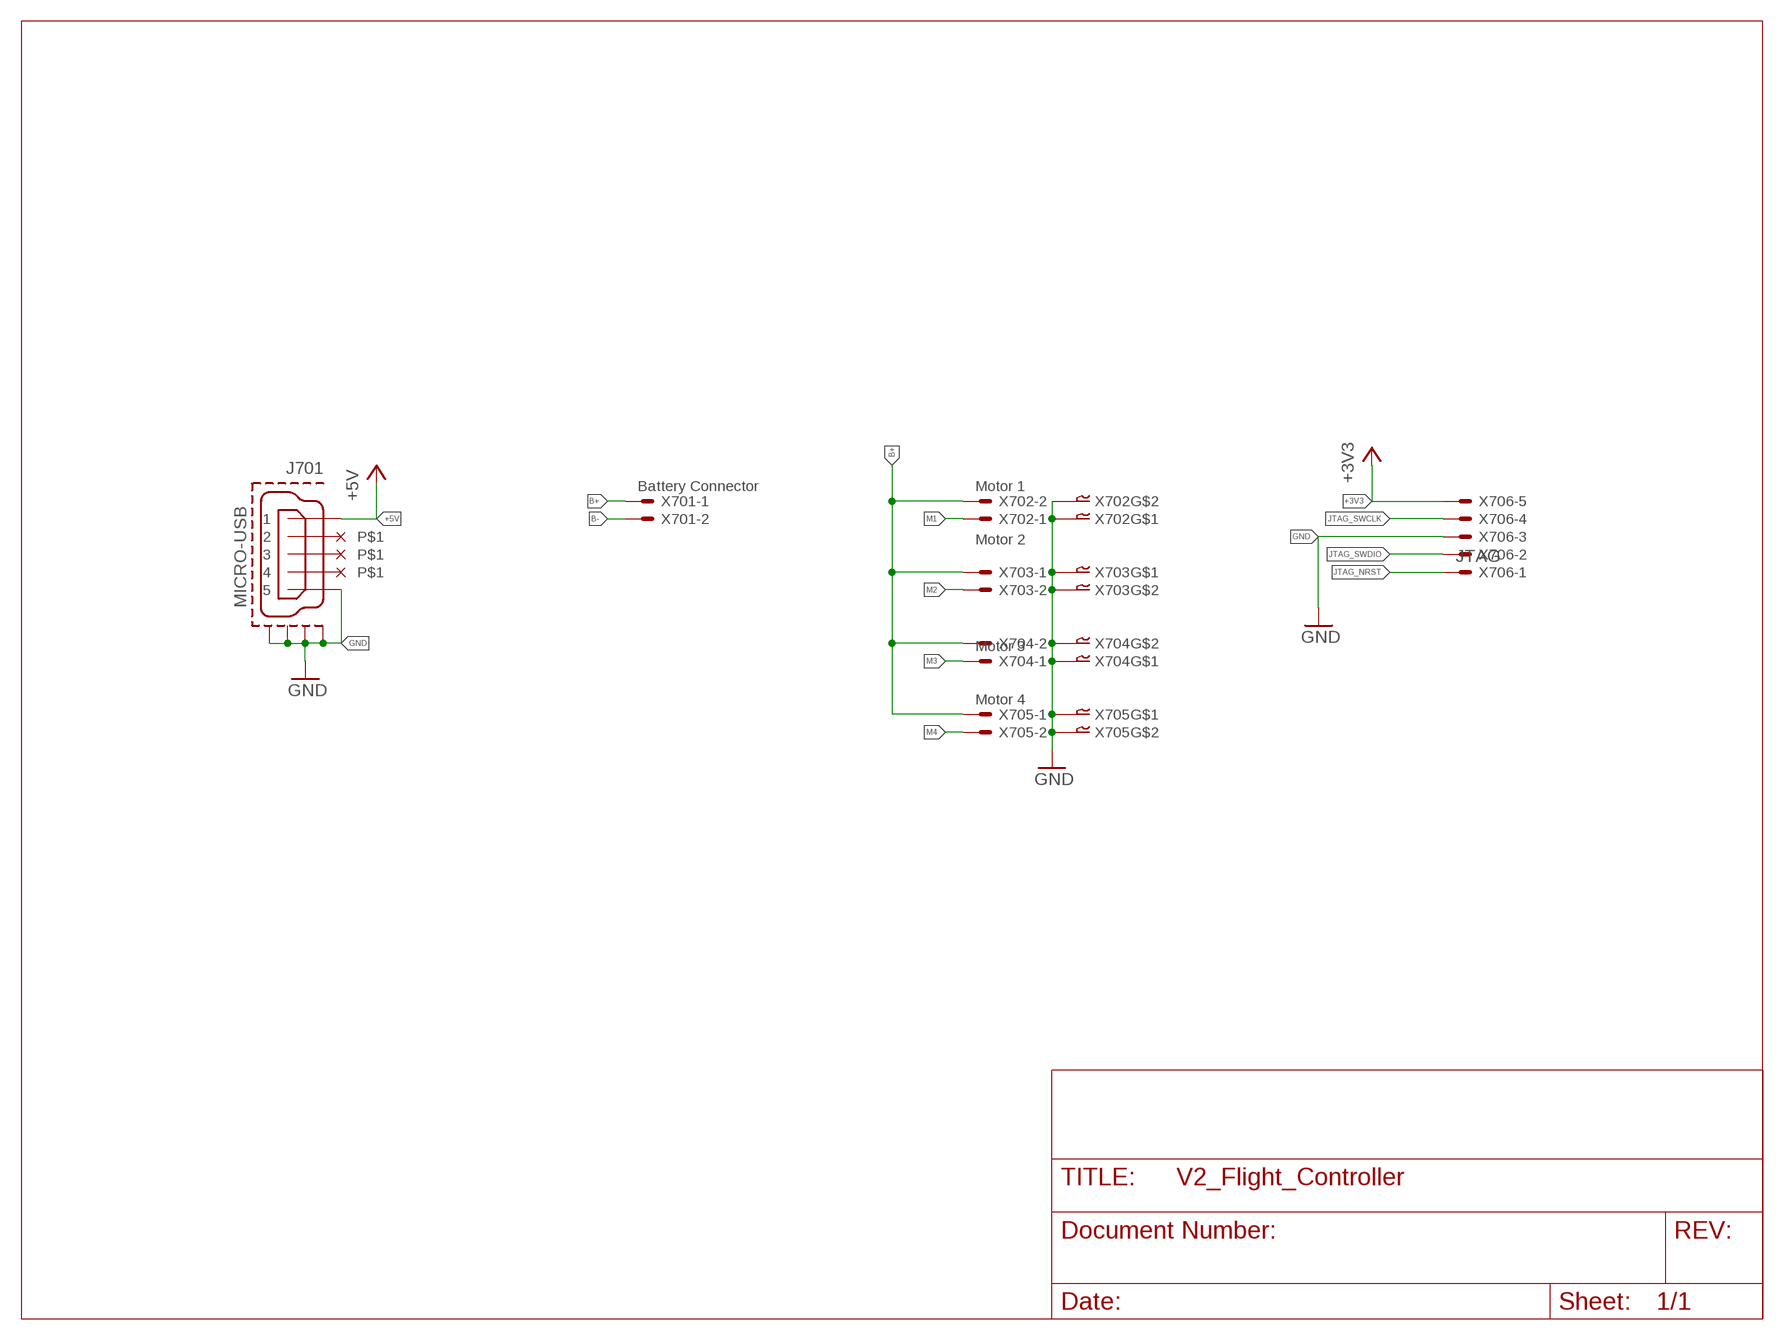
[diagram p7: schematic, module CONNECTORS, sheet 1]

### Parts
J701  MICRO-USB  MICRO-USB-RECEPTACLE47589-0001  [47589-0001]
U$1  NC  (no package)
U$2  NC  (no package)
U$3  NC  (no package)
X701  Battery Connector  SM02B-SRSS-TB  [SM02B-SRSS-TB]
X702  Motor 1  SM02B-SRSS-TB  [SM02B-SRSS-TB]
X703  Motor 2  SM02B-SRSS-TB  [SM02B-SRSS-TB]
X704  Motor 3  SM02B-SRSS-TB  [SM02B-SRSS-TB]
X705  Motor 4  SM02B-SRSS-TB  [SM02B-SRSS-TB]
X706  JTAG  53047-05  [53047-05]

### Nets
+3V3: X706.5
+5V: J701.1
B+: X701.1 X702.2 X703.1 X704.2 X705.1
B-: X701.2
GND: J701.5 J701.CASING1(GND1) J701.CASING2(GND2) J701.CASING3(GND3) J701.CASING4(GND4) X702.FIT@1 X702.FIT@2 X703.FIT@1 X703.FIT@2 X704.FIT@1 X704.FIT@2 X705.FIT@1 X705.FIT@2 X706.3
JTAG_NRST: X706.1
JTAG_SWCLK: X706.4
JTAG_SWDIO: X706.2
M1: X702.1
M2: X703.2
M3: X704.1
M4: X705.2
N$1: J701.2 U$1.P$1
N$2: J701.3 U$2.P$1
N$3: J701.4 U$3.P$1
Unconnected: X701.FIT@1 X701.FIT@2

### Library data of the parts
J701 = con-molex-usb:MICRO-USB-RECEPTACLE: MICRO USB RECEPTACLES Micro-USB Receptacles, SMT, Lead-Free from MOLEX <http://www.molex.com/>. (C) 2014 Tomasz Boleslaw CEDRO, cederom@tlen.pl, http://www.tomek.cedro.info. Version 0.1 (2014-01-17): Initial release. Version 0.2 (2014-02-06): Updated 47589-0001 footprint pins/pads/milling. Following devices are included: 1. 47589-0001 Micro-USB AB Receptacle, Bottom Mount, SMT, Lead-Free <http://www.molex.com/molex/products/datasheet.jsp?part=active/0475890001_IO_CONNECTORS.xml> (Technical Drawing <http://www.molex.com/pdm_docs/sd/475890001_sd.pdf>).
U$1-U$3 = NC:NC
X701-X705 = con-jst:?M02B-SRSS-TB: Disconnectable Crimp style connector, 1.0mm pitch 2 contacts
X706 = con-molex_modified:53?-05: CONNECTOR wire to board 1.25 mm (.049 inch) pitch header; MF: MOLEX; MPN: 53047-0510; OC_FARNELL: 9732861; OC_NEWARK: 38C9901

## Board
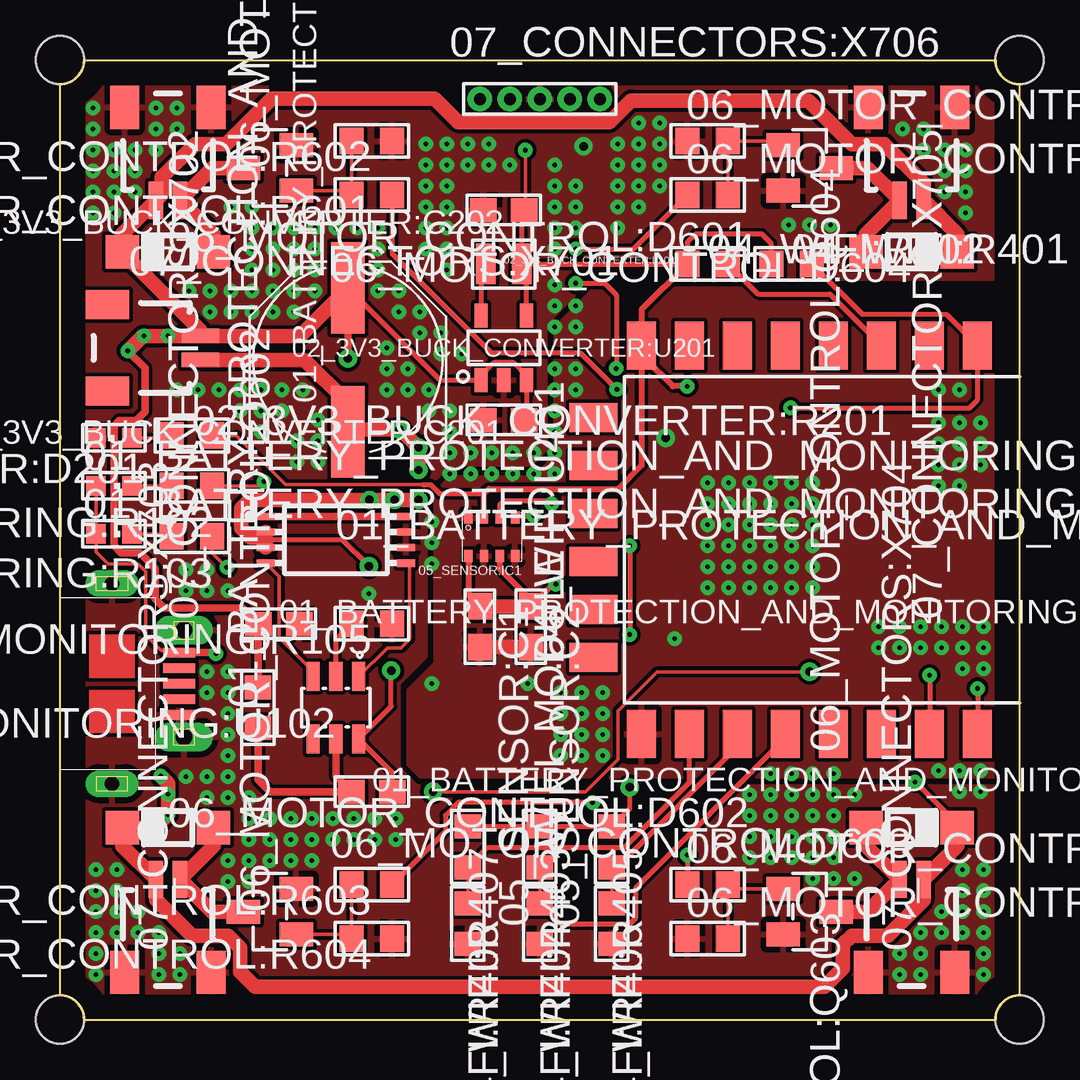
[diagram p8: board, top side]
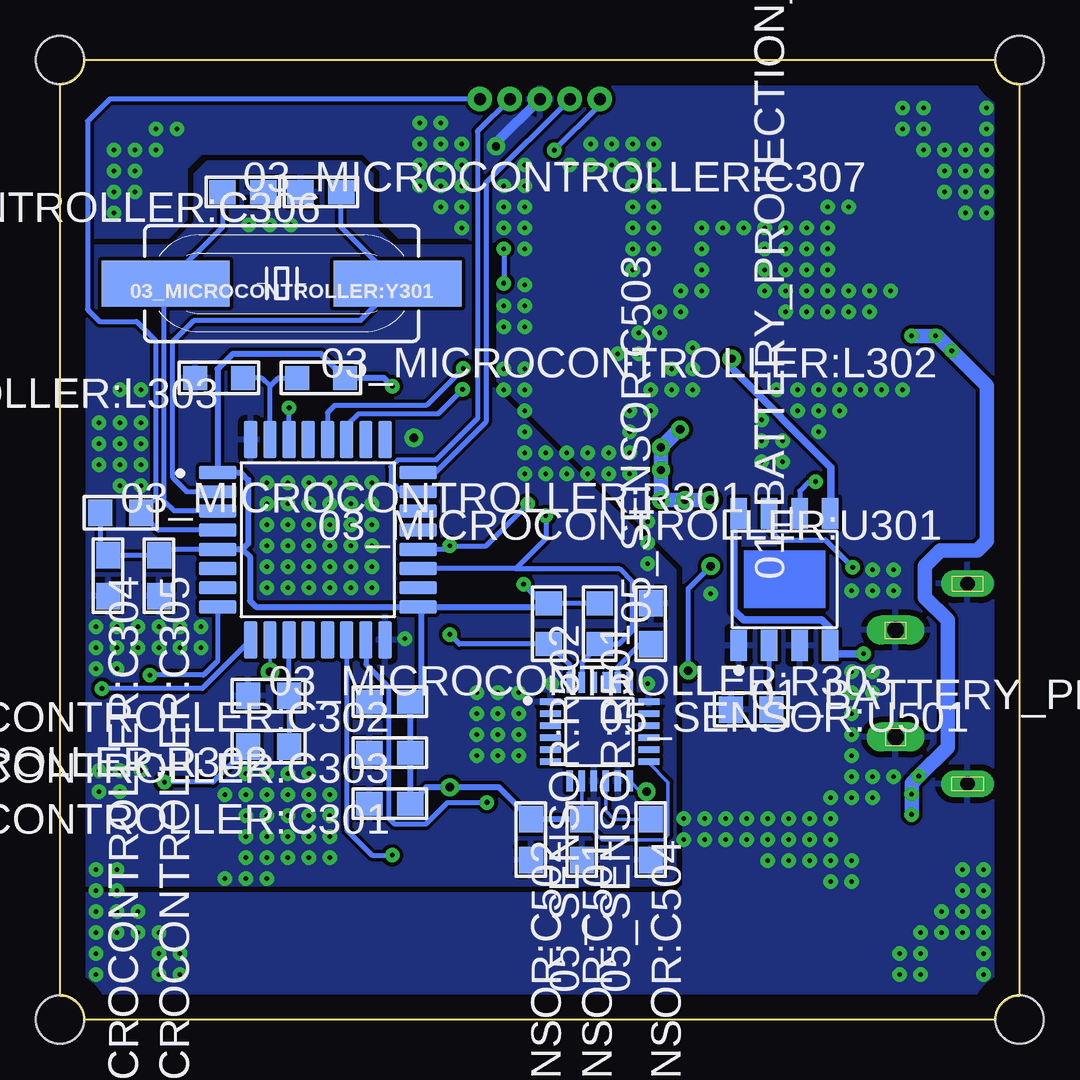
[diagram p9: board, bottom side, seen from below]

Size 40 x 40 mm. Coordinates in mm from the lower left corner, seen from the top.
Outline: 1,0 arc90 0,1 0,39 arc90 1,40 39,40 arc90 40,39 40,1 arc90 39,0 1,0
Copper layers (1*16): Top 0.035mm / dielectric 0.8mm / Bottom 0.035mm
Design rules "default *": minimum track width 6mil, minimum drill 0.2mm, track to track 6mil, track to pad 6mil, pad to pad 5mil, via to via 6mil, smd to smd 6mil, copper to edge 40mil, drill to drill 6mil, minimum pad ring 10mil, minimum via ring 8mil, stop-mask expansion 4mil, vias tented up to drill 0mil, thermal gap 10mil
Holes 2 mm at 0,0 40,0 40,40 0,40

### Footprints (pad centres in the part's own frame; a part is rotated, then mirrored left to right if it is on the bottom)
PANASONIC_E = smd 3.8 x 1.4: + 3,0; - -3,0
C0603 = smd 1.1 x 1: 1 -0.85,0; 2 0.85,0
CHIPLED_0603 = smd 0.8 x 0.8: A 0,-0.75; C 0,0.75
R0603 = smd 1 x 1.1: 1 -0.85,0; 2 0.85,0
TSSOP-8 = smd 0.3 x 0.75: 1 -0.975,-2.925; 2 -0.325,-2.925; 3 0.325,-2.925; 4 0.975,-2.925; 5 0.975,2.925; 6 0.325,2.925; 7 -0.325,2.925; 8 -0.975,2.925
SOP-8 = smd 1.3 x 0.7: 1 -2.75,1.905; 2 -2.75,0.635; 3 -2.75,-0.635; 4 -2.75,-1.905; 5 2.75,-1.905; 6 2.75,-0.635; 7 2.75,0.635; 8 2.75,1.905
SOT23-6 = smd 0.55 x 1.2: 1 -0.95,-1.3; 2 0,-1.3; 3 0.95,-1.3; 4 0.95,1.3; 5 0,1.3; 6 -0.95,1.3
SRN2009T-2R2M = smd 0.8 x 1.7: 1 -0.75,0; 2 0.75,0
SOT-23-5 = smd 1 x 0.55: 1 -1.35,0.95; 2 -1.35,0; 3 -1.35,-0.95; 4 1.35,-0.95; 5 1.35,0.95
L2012C = smd 1 x 1: 1 -1,0; 2 1,0
QFP80P900X900X160-32N = smd 1.56 x 0.55: 1 -4.18,2.8; 2 -4.18,2; 3 -4.18,1.2; 4 -4.18,0.4; 5 -4.18,-0.4; 6 -4.18,-1.2; 7 -4.18,-2; 8 -4.18,-2.8; 17 4.18,-2.8; 18 4.18,-2; 19 4.18,-1.2; 20 4.18,-0.4; 21 4.18,0.4; 22 4.18,1.2; 23 4.18,2; 24 4.18,2.8 | smd 0.55 x 1.56: 9 -2.8,-4.18; 10 -2,-4.18; 11 -1.2,-4.18; 12 -0.4,-4.18; 13 0.4,-4.18; 14 1.2,-4.18; 15 2,-4.18; 16 2.8,-4.18; 25 2.8,4.18; 26 2,4.18; 27 1.2,4.18; 28 0.4,4.18; 29 -0.4,4.18; 30 -1.2,4.18; 31 -2,4.18; 32 -2.8,4.18
HC49UP = smd 5.334 x 1.93: 1 -4.826,0; 2 4.826,0
ESP8266-ESP12E = smd 2 x 1.2: 1 0,-0.51; 2 0,-2.51; 3 0,-4.51; 4 0,-6.51; 5 0,-8.51; 6 0,-10.51; 7 0,-12.51; 8 0,-14.51; 9 16.2,-14.51; 10 16.2,-12.51; 11 16.2,-10.51; 12 16.2,-8.51; 13 16.2,-6.51; 14 16.2,-4.51; 15 16.2,-2.51; 16 16.2,-0.51 | smd 1.2 x 2: 17 3,-16.51; 18 5,-16.51; 19 7,-16.51; 20 9,-16.51; 21 11,-16.51; 22 13,-16.51
BMP280 = smd 0.35 x 0.5: 1 0.975,-0.8; 2 0.325,-0.8; 3 -0.325,-0.8; 4 -0.975,-0.8; 5 -0.975,0.8; 6 -0.325,0.8; 7 0.325,0.8; 8 0.975,0.8
QFN50P400X400X95-24N = smd 0.866 x 0.26: 1 -2.046,1.25; 2 -2.046,0.75; 3 -2.046,0.25; 4 -2.046,-0.25; 5 -2.046,-0.75; 6 -2.046,-1.25; 13 2.046,-1.25; 14 2.046,-0.75; 15 2.046,-0.25; 16 2.046,0.25; 17 2.046,0.75; 18 2.046,1.25 | smd 0.26 x 0.866: 7 -1.25,-2.046; 8 -0.75,-2.046; 9 -0.25,-2.046; 10 0.25,-2.046; 11 0.75,-2.046; 12 1.25,-2.046; 19 1.25,2.046; 20 0.75,2.046; 21 0.25,2.046; 22 -0.25,2.046; 23 -0.75,2.046; 24 -1.25,2.046
SOD123 = smd 1.4 x 1.4: A 1.9,0; C -1.9,0
SOT23 = smd 1 x 1.4: 1 -0.95,-1.1; 2 0.95,-1.1; 3 0,1.1
47589-0001 = smd 1.35 x 0.4: 1 2.8,1.3; 2 2.8,0.65; 3 2.8,0; 4 2.8,-0.65; 5 2.8,-1.3 | drill 0.6 pad 0.95 long: CASING1 0,4.175; CASING2 0,-4.175 | drill 0.7 pad 1.1 long: CASING3 3,2.236; CASING4 3,-2.22
SM02B-SRSS-TB = smd 0.6 x 1.55: 1 -0.5,2.975; 2 0.5,2.975 | smd 1.2 x 1.8: FIT@1 -1.8,-0.9; FIT@2 1.8,-0.9
53047-05 = drill 0.5 pad 0.698: 1 2.5,0; 2 1.25,0; 3 0,0; 4 -1.25,0; 5 -2.5,0

### Placement (x,y rotation side)
01_BATTERY_PROTECTION_AND_MONITORING:C101  220uF  [PANASONIC_E]  12,27.5 90 top
01_BATTERY_PROTECTION_AND_MONITORING:C102  10uF  [C0603]  9.12,16.5 0 top
01_BATTERY_PROTECTION_AND_MONITORING:C103  0.1uF  [C0603]  13,9.5 0 top
01_BATTERY_PROTECTION_AND_MONITORING:D101  STDBY_GREEN  [CHIPLED_0603]  2.25,22.25 270 top
01_BATTERY_PROTECTION_AND_MONITORING:D102  CHRG_RED  [CHIPLED_0603]  2.25,20.25 270 top
01_BATTERY_PROTECTION_AND_MONITORING:R101  4.8KΩ  [R0603]  11.19,12.92 0 bottom
01_BATTERY_PROTECTION_AND_MONITORING:R102  1KΩ  [R0603]  5.5,22.25 180 top
01_BATTERY_PROTECTION_AND_MONITORING:R103  1KΩ  [R0603]  5.5,20.15 180 top
01_BATTERY_PROTECTION_AND_MONITORING:R104  100Ω  [R0603]  8.25,13 90 top
01_BATTERY_PROTECTION_AND_MONITORING:R105  1KΩ  [R0603]  13,16.5 180 top
01_BATTERY_PROTECTION_AND_MONITORING:T101  DMN3024LSD  [TSSOP-8]  11.5,20 270 top
01_BATTERY_PROTECTION_AND_MONITORING:U101  TP4056  [SOP-8]  9.8,18.35 90 bottom
01_BATTERY_PROTECTION_AND_MONITORING:U102  DW01A  [SOT23-6]  11.5,13 180 top
02_3V3_BUCK_CONVERTER:C201  10nF  [C0603]  18.5,25 180 top
02_3V3_BUCK_CONVERTER:C202  10uF  [C0603]  18.5,33.75 180 top
02_3V3_BUCK_CONVERTER:D201  3V3_GREEN  [CHIPLED_0603]  2.25,24.25 90 top
02_3V3_BUCK_CONVERTER:L201  2.2uH  [SRN2009T-2R2M]  18.5,31.5 0 top
02_3V3_BUCK_CONVERTER:R201  1KΩ  [R0603]  5.5,24.35 0 top
02_3V3_BUCK_CONVERTER:U201  LM3670  [SOT-23-5]  18.5,28 90 top
03_MICROCONTROLLER:C301  100nF  [C0603]  26.25,9 180 bottom
03_MICROCONTROLLER:C302  100nF  [C0603]  26.25,13.25 180 bottom
03_MICROCONTROLLER:C303  4.7uF  [C0603]  26.25,11.12 180 bottom
03_MICROCONTROLLER:C304  10nF  [C0603]  38,18.5 270 bottom
03_MICROCONTROLLER:C305  1uF  [C0603]  35.88,18.5 270 bottom
03_MICROCONTROLLER:C306  20pF  [C0603]  29.12,34.5 180 bottom
03_MICROCONTROLLER:C307  20pF  [C0603]  32.38,34.5 0 bottom
03_MICROCONTROLLER:L302  FERRITE BEAD  [L2012C]  29.12,26.75 0 bottom
03_MICROCONTROLLER:L303  FERRITE BEAD  [L2012C]  33.38,26.75 180 bottom
03_MICROCONTROLLER:R301  10KΩ  [R0603]  37.48,21.12 0 bottom
03_MICROCONTROLLER:R302  2KΩ  [R0603]  31.3,11.38 180 bottom
03_MICROCONTROLLER:R303  5KΩ  [R0603]  31.3,13.5 0 bottom
03_MICROCONTROLLER:U301  STM32F030K6T6  [QFP80P900X900X160-32N]  29.25,20 0 bottom
03_MICROCONTROLLER:Y301  8MHz  [HC49UP]  30.76,30.68 180 bottom
04_WIFI:R401  10KΩ  [R0603]  30.5,31.5 0 top
04_WIFI:R402  10KΩ  [R0603]  27,31.5 0 top
04_WIFI:R403  10KΩ  [R0603]  20,7.2 270 top
04_WIFI:R404  10KΩ  [R0603]  20,4 270 top
04_WIFI:R405  10KΩ  [R0603]  23,7.2 270 top
04_WIFI:R406  10KΩ  [R0603]  23,4 270 top
04_WIFI:R407  10KΩ  [R0603]  17,7.2 270 top
04_WIFI:R408  10KΩ  [R0603]  17,4 270 top
04_WIFI:U401  WIFI_MODULE  [ESP8266-ESP12E]  38.75,28.1 270 top
05_SENSOR:C1  100nF, 50V, ±10%  [C0603]  17.5,16.38 270 top
05_SENSOR:C2  100nF, 50V, ±10%  [C0603]  19.62,16.38 270 top
05_SENSOR:C501  0.1uF, 4V, ±10%  [C0603]  18.25,7.5 270 bottom
05_SENSOR:C502  10nF, 4V, ±10%  [C0603]  20.38,7.5 270 bottom
05_SENSOR:C503  2.2nF, 50V, ±10%  [C0603]  15.38,16.5 90 bottom
05_SENSOR:C504  0.1uF, 2V, ±10%  [C0603]  15.38,7.5 270 bottom
05_SENSOR:IC1  BMP280  [BMP280]  18,20.12 180 top
05_SENSOR:R501  4.7k  [R0603]  17.5,16.5 270 bottom
05_SENSOR:R502  4.7k  [R0603]  19.62,16.5 270 bottom
05_SENSOR:U501  MPU-6050  [QFN50P400X400X95-24N]  17.5,12 0 bottom
06_MOTOR_CONTROL:D601  1N5819  [SOD123]  4.5,32 0 top
06_MOTOR_CONTROL:D602  1N5819  [SOD123]  4.5,8 0 top
06_MOTOR_CONTROL:D603  1N5819  [SOD123]  35.5,8 180 top
06_MOTOR_CONTROL:D604  1N5819  [SOD123]  35.5,32 180 top
06_MOTOR_CONTROL:Q601  SI2302  [SOT23]  8.75,35.5 90 top
06_MOTOR_CONTROL:Q602  SI2302  [SOT23]  8.75,4.5 90 top
06_MOTOR_CONTROL:Q603  SI2302  [SOT23]  31.25,4.5 270 top
06_MOTOR_CONTROL:Q604  SI2302  [SOT23]  31.25,35.5 270 top
06_MOTOR_CONTROL:R601  1KΩ  [R0603]  13,34.38 180 top
06_MOTOR_CONTROL:R602  4.7KΩ  [R0603]  13,36.62 180 top
06_MOTOR_CONTROL:R603  1KΩ  [R0603]  13,5.62 180 top
06_MOTOR_CONTROL:R604  4.7KΩ  [R0603]  13,3.38 180 top
06_MOTOR_CONTROL:R605  1KΩ  [R0603]  27,5.62 0 top
06_MOTOR_CONTROL:R606  4.7KΩ  [R0603]  27,3.38 0 top
06_MOTOR_CONTROL:R607  1KΩ  [R0603]  27,34.38 0 top
06_MOTOR_CONTROL:R608  4.7KΩ  [R0603]  27,36.62 0 top
07_CONNECTORS:J701  MICRO-USB  [47589-0001]  2.17,14 0 top
07_CONNECTORS:X701  Battery Connector  [SM02B-SRSS-TB]  2.88,28 270 top
07_CONNECTORS:X702  Motor 1  [SM02B-SRSS-TB]  4.5,37.12 180 top
07_CONNECTORS:X703  Motor 2  [SM02B-SRSS-TB]  4.5,2.88 0 top
07_CONNECTORS:X704  Motor 3  [SM02B-SRSS-TB]  35.5,2.88 0 top
07_CONNECTORS:X705  Motor 4  [SM02B-SRSS-TB]  35.5,37.12 180 top
07_CONNECTORS:X706  JTAG  [53047-05]  20,38.38 0 top

### Tracks (layer width: path | path; a pad name or v marks a point on that pad's centre or on a via)
01_BATTERY_PROTECTION_AND_MONITORING:CHRG  (via drill 0.2 pad 0.45)
  Top 0.152: v6.95,18.85 6.35,19.45 01_BATTERY_PROTECTION_AND_MONITORING:R103.1
  Bottom 0.2: v6.95,18.85 8.1,20 9.98,20 10.44,20.45 01_BATTERY_PROTECTION_AND_MONITORING:U101.7
01_BATTERY_PROTECTION_AND_MONITORING:CHRG_LED
  Top 0.152: 01_BATTERY_PROTECTION_AND_MONITORING:D102.C 4.55,20.25 01_BATTERY_PROTECTION_AND_MONITORING:R103.2
01_BATTERY_PROTECTION_AND_MONITORING:CS
  Top 0.2: 01_BATTERY_PROTECTION_AND_MONITORING:U102.2 11.5,15.85 01_BATTERY_PROTECTION_AND_MONITORING:R105.2
01_BATTERY_PROTECTION_AND_MONITORING:D2S
  Top 0.305: 01_BATTERY_PROTECTION_AND_MONITORING:T101.1 01_BATTERY_PROTECTION_AND_MONITORING:T101.8
01_BATTERY_PROTECTION_AND_MONITORING:OC
  Top 0.152: 01_BATTERY_PROTECTION_AND_MONITORING:T101.4 9.12,18.48 9.12,15.94 10.55,14.51 01_BATTERY_PROTECTION_AND_MONITORING:U102.3
01_BATTERY_PROTECTION_AND_MONITORING:OD
  Top 0.152: 01_BATTERY_PROTECTION_AND_MONITORING:T101.5 14.58,18.87 14.58,15.86 14.22,15.5 13.65,15.5 01_BATTERY_PROTECTION_AND_MONITORING:U102.1
01_BATTERY_PROTECTION_AND_MONITORING:PROG
  Bottom 0.2: 01_BATTERY_PROTECTION_AND_MONITORING:R101.2 10.44,13.02 01_BATTERY_PROTECTION_AND_MONITORING:U101.2
01_BATTERY_PROTECTION_AND_MONITORING:STDBY  (via drill 0.2 pad 0.45)
  Top 0.152: v8.5,22.43 8.32,22.25 01_BATTERY_PROTECTION_AND_MONITORING:R102.1
  Bottom 0.2: v8.5,22.43 8.78,22.43 9.16,22.04 01_BATTERY_PROTECTION_AND_MONITORING:U101.6
01_BATTERY_PROTECTION_AND_MONITORING:STDBY_LED
  Top 0.152: 01_BATTERY_PROTECTION_AND_MONITORING:D101.C 01_BATTERY_PROTECTION_AND_MONITORING:R102.2
01_BATTERY_PROTECTION_AND_MONITORING:VCC
  Top 0.305: 01_BATTERY_PROTECTION_AND_MONITORING:R104.1 8.25,10 8.75,9.5 01_BATTERY_PROTECTION_AND_MONITORING:C103.1 11.5,10.15 01_BATTERY_PROTECTION_AND_MONITORING:U102.5
02_3V3_BUCK_CONVERTER:LED_3V3
  Top 0.152: 02_3V3_BUCK_CONVERTER:D201.A 4.55,24.25 02_3V3_BUCK_CONVERTER:R201.1
02_3V3_BUCK_CONVERTER:SW
  Top 0.2: 02_3V3_BUCK_CONVERTER:U201.5 17.55,31.3 02_3V3_BUCK_CONVERTER:L201.1
03_MICROCONTROLLER:BAT_MON
  Bottom 0.2: 03_MICROCONTROLLER:R302.1 03_MICROCONTROLLER:R303.2 03_MICROCONTROLLER:U301.11
03_MICROCONTROLLER:BOOT0
  Bottom 0.2: 03_MICROCONTROLLER:U301.31 31.25,26.4 | 31.25,26.4 31.6,26.75 03_MICROCONTROLLER:L303.1 | 31.25,26.4 30.9,26.75 03_MICROCONTROLLER:L302.1
03_MICROCONTROLLER:XTAL_IN
  Bottom 0.2: 03_MICROCONTROLLER:C306.1 28.27,33.02 03_MICROCONTROLLER:Y301.1 27.46,29.15 34.4,29.15 35.3,28.25 35.3,22.6 34.7,22 03_MICROCONTROLLER:U301.2
03_MICROCONTROLLER:XTAL_OUT
  Bottom 0.2: 03_MICROCONTROLLER:C307.1 33.23,33.04 03_MICROCONTROLLER:Y301.2 35.65,30.62 35.65,21.6 35.25,21.2 03_MICROCONTROLLER:U301.3
04_WIFI:CH_PD
  Top 0.2: 04_WIFI:R402.2 29.1,30.25 32.09,30.25 04_WIFI:U401.3
04_WIFI:GPIO0
  Top 0.152: 04_WIFI:R403.2 04_WIFI:R404.1
  Top 0.2: 04_WIFI:R404.1 20.85,4 23.75,4 24,4.25 24,5.5 30.24,11.74 04_WIFI:U401.12
04_WIFI:GPIO2
  Top 0.152: 04_WIFI:R405.2 04_WIFI:R406.1
  Top 0.2: 04_WIFI:R405.2 23.4,6.75 23.61,6.75 28.24,11.38 04_WIFI:U401.11
04_WIFI:GPIO15
  Top 0.152: 04_WIFI:R407.2 04_WIFI:R408.1
  Top 0.2: 04_WIFI:R407.2 17.82,7.17 23.53,7.17 26.24,9.88 04_WIFI:U401.10
05_SENSOR:CPOUT
  Bottom 0.2: 05_SENSOR:U501.20 16.75,14.7 15.8,15.65 05_SENSOR:C503.1
05_SENSOR:REGOUT
  Bottom 0.152: 05_SENSOR:U501.10 17.25,8.7 16.9,8.35 05_SENSOR:C504.1
06_MOTOR_CONTROL:M1_GATE
  Top 0.152: 06_MOTOR_CONTROL:Q601.1 11.97,34.55 06_MOTOR_CONTROL:R601.2 06_MOTOR_CONTROL:R602.2
06_MOTOR_CONTROL:M2_GATE
  Top 0.152: 06_MOTOR_CONTROL:R603.2 06_MOTOR_CONTROL:R604.2 11.97,3.55 06_MOTOR_CONTROL:Q602.1
06_MOTOR_CONTROL:M3_GATE
  Top 0.152: 06_MOTOR_CONTROL:Q603.1 28.02,5.45 06_MOTOR_CONTROL:R605.2 06_MOTOR_CONTROL:R606.2
06_MOTOR_CONTROL:M4_GATE
  Top 0.152: 06_MOTOR_CONTROL:Q604.1 29.98,36.62 06_MOTOR_CONTROL:R608.2 06_MOTOR_CONTROL:R607.2
+3V3  (via drill 0.2 pad 0.45, 0.35)
  Top 0.152: 02_3V3_BUCK_CONVERTER:R201.2 7.35,24.35 9.4,22.3 15.12,22.3 | 02_3V3_BUCK_CONVERTER:C202.1 19.4,33.8 v19.4,36.24
  Top 0.2: 02_3V3_BUCK_CONVERTER:U201.4 19.45,31.3 02_3V3_BUCK_CONVERTER:L201.2 | 04_WIFI:R407.1 04_WIFI:R405.1 | 04_WIFI:R401.1 29.65,32.35 29.25,32.75 26.5,32.75 26.15,32.4 04_WIFI:R402.1 02_3V3_BUCK_CONVERTER:L201.2 | 04_WIFI:R405.1 23.75,8.8 v23.75,9.68 | 04_WIFI:R403.1 04_WIFI:R405.1 | 02_3V3_BUCK_CONVERTER:L201.2 19.25,33.65 02_3V3_BUCK_CONVERTER:C202.1 | 15.12,22.3 15.45,22.3 15.82,21.93 17.68,21.93
  Top 0.254: 05_SENSOR:IC1.6 18.32,18.8 19.62,17.5 05_SENSOR:C2.1 20.55,18.15 v20.68,18.15 | 05_SENSOR:IC1.8 17.02,17.7 05_SENSOR:C1.1 | v26.15,26.4 25.55,26.4 24.41,27.54 24.41,27.93 04_WIFI:U401.8 | 04_WIFI:U401.8 24.24,23.11 23.26,22.12 17.88,22.12 17.68,21.93 05_SENSOR:IC1.2 | 04_WIFI:R402.1 24.24,29.59 04_WIFI:U401.8
  Top 0.61: 05_SENSOR:C1.1 05_SENSOR:C2.1
  Bottom 0.152: 05_SENSOR:U501.8 05_SENSOR:C501.1 17.4,7.5 14.85,7.5 14.65,7.7 14.65,9.89 15.45,10.7 05_SENSOR:U501.13
  Bottom 0.2: 03_MICROCONTROLLER:U301.5 35.62,19.6 03_MICROCONTROLLER:C305.1 03_MICROCONTROLLER:C304.1 38.33,19.35 03_MICROCONTROLLER:R301.1 | 19.68,17.3 05_SENSOR:R502.1 05_SENSOR:R501.1 | v19.4,36.24 17.5,38.14 07_CONNECTORS:X706.5
  Bottom 0.254: v20.68,18.15 19.88,17.35 05_SENSOR:R502.1 | 32.4,19.6 32.08,19.28 32.08,17.46 31.82,17.2 03_MICROCONTROLLER:U301.17 | 32.4,19.6 32.15,19.85 32.15,22.5 32.45,22.8 03_MICROCONTROLLER:U301.1 33.43,27.12 32.8,27.75 29.12,27.75 03_MICROCONTROLLER:L302.2 26.5,26.75 v26.15,26.4 | 32.4,19.6 03_MICROCONTROLLER:U301.5 | 03_MICROCONTROLLER:U301.17 19.77,17.2 19.68,17.3 | 03_MICROCONTROLLER:U301.17 24.95,17.07 24.95,13.71 03_MICROCONTROLLER:C302.1 03_MICROCONTROLLER:C303.1 03_MICROCONTROLLER:C301.1 24.72,9.68 v23.75,9.68 21.71,9.68 05_SENSOR:C502.1 05_SENSOR:C501.1
+5V  (via drill 0.2 pad 0.45)
  Top 0.152: 01_BATTERY_PROTECTION_AND_MONITORING:D101.A 01_BATTERY_PROTECTION_AND_MONITORING:D102.A 1.5,19.5 2,19 3.25,19 3.58,18.68 3.58,16.04 4.22,15.39 4.88,15.39 07_CONNECTORS:J701.1
  Top 0.2: 6.45,15.3 v6.5,15.25
  Top 0.305: 07_CONNECTORS:J701.1 6.45,15.3
  Bottom 0.2: 7.54,15.25 01_BATTERY_PROTECTION_AND_MONITORING:U101.4 | 11.9,20.91 01_BATTERY_PROTECTION_AND_MONITORING:U101.8
  Bottom 0.305: v6.5,15.25 7.54,15.25 | 01_BATTERY_PROTECTION_AND_MONITORING:U101.4 7.89,16.3 8.25,16.65 11.5,16.65 11.9,17.05 11.9,20.91
BATTERY_+VE  (via drill 0.2 pad 0.45, 0.35)
  Top 0.152: 12,30.05 12.22,30.27
  Top 0.2: 01_BATTERY_PROTECTION_AND_MONITORING:C101.+ 12.22,30.27 15.85,26.65 02_3V3_BUCK_CONVERTER:U201.1 17.55,26.83 18.12,27.4 18.88,27.4 19.45,26.83 02_3V3_BUCK_CONVERTER:U201.3 19.45,25.1 02_3V3_BUCK_CONVERTER:C201.1 | v35.65,9.9 37.4,8.15 06_MOTOR_CONTROL:D603.C
  Top 0.305: v2.83,27.88 3.55,27.15 3.55,25.35 3.17,24.98 2.48,24.98 2.25,24.75 2.25,19.75 2.55,19.45 3.34,19.45 3.98,18.81 3.98,17.52 4.34,17.16 7.62,17.16 01_BATTERY_PROTECTION_AND_MONITORING:C102.1 8.25,16.48 01_BATTERY_PROTECTION_AND_MONITORING:R104.2 | v12,27.55 12,30.05
  Top 0.61: 07_CONNECTORS:X701.1 5.85,28.75 06_MOTOR_CONTROL:D601.C 2.6,32.75 07_CONNECTORS:X702.2 4.24,34.39 4.24,35.11 5.63,36.5 6.92,36.5 8.82,38.39 15.61,38.39 16.59,37.41 22.91,37.41 23.81,38.31 31.19,38.31 33,36.5 34.37,36.5 36,34.87 07_CONNECTORS:X705.1 37.4,32.75 06_MOTOR_CONTROL:D604.C | 07_CONNECTORS:X701.1 10,28.5 01_BATTERY_PROTECTION_AND_MONITORING:C101.+ | 06_MOTOR_CONTROL:D603.C 37.4,7.25 07_CONNECTORS:X704.2 36,5 34.5,3.5 33,3.5 32.64,3.14 32.64,2.14 31.86,1.36 8.14,1.36 7.5,2 7.5,3 7,3.5 5.5,3.5 4,5 07_CONNECTORS:X703.1 2.6,7.25 06_MOTOR_CONTROL:D602.C 3.95,8 v4.5,8.55 v4.5,9.4 4.5,9.85 v4.2,10.15 | 07_CONNECTORS:X701.1 v4.5,28.5 v3.5,28.5 3.45,28.5 v2.83,27.88
  Bottom 0.152: 01_BATTERY_PROTECTION_AND_MONITORING:U101.5 7.87,21.13
  Bottom 0.2: 03_MICROCONTROLLER:R302.2 33.62,9.9 v35.65,9.9
  Bottom 0.305: 7.87,21.13 7.87,23.02 12,27.15 v12,27.55
  Bottom 0.61: v4.5,8.55 v4.5,9.4 4.5,9.85 v4.2,10.15 3,11.35 3,16.65 3.95,17.6 3.95,18.9 3.3,19.55 1.76,19.55 1.36,19.95 1.36,26.43 3.43,28.5 v3.5,28.5 v4.5,28.5
BATTERY_-VE  (via drill 0.35)
  Top 0.2: 01_BATTERY_PROTECTION_AND_MONITORING:T101.2 8.57,20.1 8.57,20 | 8.57,20 01_BATTERY_PROTECTION_AND_MONITORING:T101.3 | v13.81,14.55 13.81,13.06 01_BATTERY_PROTECTION_AND_MONITORING:U102.6 13.85,10.3 01_BATTERY_PROTECTION_AND_MONITORING:C103.2 | v12.88,18.9 11.78,20 8.57,20
  Top 0.61: 8.57,20.1 7.95,20.1 7.55,20.5 7.55,21.31 7.9,21.66 v12.9,21.66 v13.95,21.66 v14.95,21.66 | 07_CONNECTORS:X701.2 10.2,27.5 12,25.7 12,24.6 | 12,24.6 01_BATTERY_PROTECTION_AND_MONITORING:C101.- | 12,24.6 v14.15,24.6 14.2,24.6 v14.95,23.85 v14.95,22.91 | 01_BATTERY_PROTECTION_AND_MONITORING:T101.2 01_BATTERY_PROTECTION_AND_MONITORING:T101.3
  Bottom 0.2: v13.81,14.55 13.81,17.97 v12.88,18.9
  Bottom 0.61: v12.9,21.66 v14.95,21.66 v14.95,22.91 v14.95,23.85 14.2,24.6 v14.15,24.6
GND  (via drill 0.2 pad 0.45, 0.35)
  Top 0.152: 16.77,3.38 04_WIFI:R408.2 | 04_WIFI:R404.2 20.23,3.38
  Top 0.61: 05_SENSOR:C1.2 05_SENSOR:C2.2
  Bottom 0.406: 07_CONNECTORS:X706.3 21.82,36.55 v21.82,36.4
  other vias: 25.25,24.25 37.62,14.62 38.5,14.62 34.12,16.38 34.12,15.5 35,16.38 37.62,15.5 38.5,15.5 38.5,16.38 37.62,16.38 35.88,16.38 35.88,15.5 36.75,16.38 36.75,15.5 35,15.5 27,21.5 27,22.38 27,20.62 27,19.75 27,18.88 27,18 4.12,1.88 4.12,2.75 5,2.75 27.88,22.38 28.75,22.38 29.62,22.38 30.5,22.38 31.38,22.38 36.62,22.25 37.5,22.25 36.62,23.12 36.62,24 36.62,24.88 37.5,24.88 37.5,23.12 37.5,24 38.38,23.12 38.38,24 38.38,24.88 36.62,26.25 37.5,26.25 37.75,33.62 37.75,34.5 37.75,35.38 37.75,36.25 36.88,36.25 36.88,35.38 36.88,34.5 36,36.25 36,37.12 35.12,37.12 27.88,21.5 27.88,20.62 27.88,19.75 27.88,18.88 27.88,18 28.75,18 29.62,18 30.5,18 31.38,18 31.38,18.88 31.38,19.75 31.38,20.62 31.38,21.5 30.5,21.5 29.62,21.5 28.75,21.5 28.75,20.62 28.75,19.75 28.75,18.88 29.62,18.88 30.5,18.88 30.5,19.75 30.5,20.62 29.62,20.62 29.62,19.75 29.62,10.25 30.5,10.25 31.38,10.25 32.25,10.25 33.12,9.38 33.12,5.88 32.25,5.88 31.38,5.88 28.75,9.38 28.75,8.5 28.75,7.62 28.75,6.75 29.62,9.38 30.5,9.38 31.38,9.38 32.25,9.38 32.25,8.5 32.25,7.62 32.25,6.75 31.38,6.75 30.5,6.75 29.62,6.75 29.62,7.62 29.62,8.5 30.5,8.5 30.5,7.62 31.38,7.62 31.38,8.5 36.62,10.38 37.5,10.38 38.38,10.38 37.5,9.5 38.38,9.5 38.5,6.25 38.5,1.88 35.88,1.88 37.62,6.25 37.62,5.38 38.5,5.38 37.62,4.5 37.62,3.62 38.5,3.62 38.5,2.75 38.5,4.5 36.75,4.5 36.75,3.62 35.88,3.62 35.88,2.75 35,2.75 35,1.88 5,1.88 4.12,3.62 1.5,6.25 3.25,3.62 2.38,3.62 1.5,3.62 1.5,2.75 1.5,1.88 1.5,4.5 1.5,5.38 2.38,4.5 3.25,4.5 2.38,5.38 2.38,6.25 19.5,14 15.5,14 20.88,13.62 21.75,13.62 22.62,13.62 22.62,12.75 21.75,12.75 20.88,12.75 20.88,11.88 20.88,11 21.75,11 22.62,11 22.62,11.88 21.75,11.88 7.88,6.62 7.88,5.75 7,5.75 7,6.62 7,9.25 7,10.12 6.12,10.12 5.25,10.12 6.12,9.25 7.88,9.25 7.88,8.38 7.88,7.5 8.75,7.5 9.62,7.5 9.62,8.38 8.75,8.38 7,11 7,11.88 7,12.75 7,13.62 7,14.5 6.12,14.5 6.12,13.62 10.5,8.38 10.5,7.5 11.38,8.38 12.25,8.38 12.25,7.5 11.38,7.5 13.12,7.5 14,7.5 14,8.38 13.12,8.38 10.5,6.62 9.62,6.62 8.75,6.62 7,17.88 6.12,17.88 5.25,17.88 5.25,18.75 6.12,18.75 9.88,23.25 9.88,24.12 10.75,24.12 10.75,23.25 10.75,25 8.38,24.5 9.25,25.38 10.12,26.25 9.25,26.25 8.38,26.25 8.38,25.38 7.5,25.38 7.5,26.25 6.62,26.25 5.75,26.25 4.88,26.25 21.5,27.12 21.5,26.25 20.62,22.75 20.62,27.12 20.62,26.25 20.62,25.38 20.62,24.5 20.62,23.62 19.75,23.62 19.75,22.75 18.88,22.75 18.88,23.62 18,23.62 18,22.75 17.12,23.62 17.12,22.75 16.25,22.75 16.25,23.62 16.25,24.5 16.25,25.38 15.38,25.38 15.38,26.25 14.5,26.25 13.62,26.25 13.62,27.12 13.62,28 14.5,27.12 23.25,33 24.12,33.88 25,34.75 25,35.62 25,36.5 25,37.38 24.12,37.38 24.12,36.5 24.12,35.62 24.12,34.75 23.25,33.88 23.25,34.75 23.25,35.62 23.25,36.5 20.62,30.62 20.62,29.75 20.62,28.88 21.5,28.88 21.5,29.75 20.62,35.62 20.62,34.75 21.5,34.75 21.5,33.88 21.5,33 20.62,33 20.62,33.88 20.62,32.12 16.75,27.75 13.25,31.25 13.25,30.38 14.12,30.38 14.12,29.5 15,29.5 15,28.62 15.88,28.62 15.88,27.75 6.25,30.38 6.25,29.5 5.38,30.38 7.12,33.88 8,33.88 8,33 8.88,33 8,32.12 8,31.25 7.12,30.38 7.12,29.5 8,30.38 8,29.5 8.88,29.5 9.75,29.5 9.75,30.38 10.62,30.38 10.62,31.25 10.62,32.12 10.62,33 9.75,33 11.5,33 12.38,33 13.25,33 13.25,32.12 8.88,32.12 9.75,32.12 9.75,31.25 8.88,31.25 8.88,30.38 16.12,31.25 18.75,35.62 15.25,32.12 16.12,32.12 16.12,33 15.25,33 15.25,33.88 16.12,33.88 16.12,34.75 15.25,34.75 15.25,35.62 16.12,35.62 15.25,36.5 16.12,36.5 17,36.5 17,35.62 17.88,35.62 17.88,36.5 4,38 1.38,38 4.88,38 4.88,37.12 4,37.12 4,36.25 3.12,36.25 3.12,35.38 3.12,34.5 2.25,33.62 2.25,34.5 1.38,34.5 1.38,33.62 2.25,35.38 2.25,36.25 1.38,37.12 1.38,36.25 1.38,35.38 25.62,15.88 30.38,33.12 31.25,33.12 32.12,33.12 12.88,17.75 15.5,20.75 15.5,19.88 15.5,19
  pour Top: 40,30.5 22.25,30.5 20.62,28.88 20.62,23.75 20.75,23.62 19.75,22.62 17,22.62 16.25,22.62 15.62,22 15.62,14.88 14.75,14 14.5,13.75 14.5,12 14.5,10.62 15,10.12 40,10.12
  pour Top: 40,30.88 40,40 0,40 0,0 40,0 40,9.75 14.88,9.75 14.12,10.5 14.12,14 15.25,15.12 15.25,22.12 16.25,23.12 19.62,23.12 20.25,23.75 20.25,29 22.12,30.88
  pour Bottom: 40,32.25 35.38,32.25 34.38,33.25 34.38,35.25 33.88,35.75 27.5,35.75 27,35.25 27,33.12 26.12,32.25 22.88,32.25 22.12,31.5 22.12,26.5 17.38,21.75 14.38,18.75 14.38,15 14.38,6 14.75,5.62 39.75,5.62 40,5.62
  pour Bottom: 40,5.25 14.38,5.25 14,5.62 14,18.88 21.75,26.62 21.75,31.38 23,32.62 25.88,32.62 26.62,33.38 26.62,35.38 27.38,36.12 34.12,36.12 34.75,35.5 34.75,33.38 35.5,32.62 40,32.62 40,40 0,40 0,0 40,0
I2C_SCL  (via drill 0.2 pad 0.45)
  Top 0.2: 05_SENSOR:IC1.4 19.05,21 v19.75,21
  Bottom 0.2: 05_SENSOR:U501.23 18.25,14.9 05_SENSOR:R501.2 16.7,15.65 16.13,16.22 16.13,18.25 16.68,18.8 21,18.8 | 21,18.8 03_MICROCONTROLLER:U301.19 | 21,18.8 19.75,20.05 v19.75,21
I2C_SDA  (via drill 0.2 pad 0.45)
  Top 0.2: v20.5,21.5 20.38,21.62 18.5,21.62 18.32,21.45 05_SENSOR:IC1.3 | v23.75,19.75 v23.75,16.05
  Bottom 0.2: 05_SENSOR:U501.24 18.75,14.78 05_SENSOR:R502.2 23.35,15.65 v23.75,16.05 | 03_MICROCONTROLLER:U301.20 23.9,19.6 v23.75,19.75 22.25,19.75 v20.5,21.5
IMU_INT  (via drill 0.35)
  Top 0.152: v15.55,9.5 21.9,9.5 23.25,10.85 23.25,12.86 24.89,14.5 v31.25,14.5
  Bottom 0.152: 05_SENSOR:U501.12 15.8,9.5 v15.55,9.5 | 03_MICROCONTROLLER:U301.10 v31.25,14.5
M1
  Top 0.61: 06_MOTOR_CONTROL:D601.A 6.4,32.75 07_CONNECTORS:X702.1 6.35,35.5 06_MOTOR_CONTROL:Q601.3
M1_PWM  (via drill 0.2 pad 0.45)
  Top 0.2: 06_MOTOR_CONTROL:R601.1 13.85,31.92 17.97,27.8 21.69,27.8 v23.22,26.27
  Bottom 0.2: v23.22,26.27 24.24,25.25 27.55,25.25 28.05,24.75 03_MICROCONTROLLER:U301.27
M2
  Top 0.61: 06_MOTOR_CONTROL:D602.A 6.4,7.25 07_CONNECTORS:X703.2 6.35,4.5 06_MOTOR_CONTROL:Q602.3
M2_PWM  (via drill 0.2 pad 0.45)
  Top 0.2: 06_MOTOR_CONTROL:R603.1 16.06,7.84 16.06,8.52 16.59,9.05 v22.2,9.05
  Bottom 0.2: 03_MICROCONTROLLER:U301.15 27.25,14.81 26.3,13.86 26.3,8.4 26.05,8.15 24.75,8.15 23.85,9.05 v22.2,9.05
M3
  Top 0.61: 06_MOTOR_CONTROL:Q603.3 33.65,4.5 07_CONNECTORS:X704.1 33.6,7.25 06_MOTOR_CONTROL:D603.A
M3_PWM  (via drill 0.2 pad 0.45)
  Top 0.2: v26.15,6.85 06_MOTOR_CONTROL:R605.1
  Bottom 0.2: v26.15,6.85 27,6.85 28.05,7.9 03_MICROCONTROLLER:U301.14
M4
  Top 0.61: 06_MOTOR_CONTROL:Q604.3 33.65,35.5 07_CONNECTORS:X705.2 33.6,32.75 06_MOTOR_CONTROL:D604.A
M4_PWM  (via drill 0.2 pad 0.45)
  Top 0.2: v21.5,30.69 22.7,30.69 23.2,30.19 23.2,27.15 v23.18,27.14 | v21.5,32.12 23.9,32.12 06_MOTOR_CONTROL:R607.1
  Bottom 0.2: v21.5,32.12 v21.5,30.69 | v23.18,27.14 24.72,25.6 28.55,25.6 28.85,25.3 03_MICROCONTROLLER:U301.28
NRST
  Bottom 0.2: 03_MICROCONTROLLER:U301.4 35.9,20.4 03_MICROCONTROLLER:R301.2 36,21.75 36,28.3 36.8,29.1 38.35,29.1 38.85,29.6 38.85,37.45 37.92,38.38 07_CONNECTORS:X706.1
SWCLK
  Bottom 0.2: 07_CONNECTORS:X706.4 22.25,34.88 22.25,24.9 24.35,22.8 03_MICROCONTROLLER:U301.24
SWDIO
  Bottom 0.2: 03_MICROCONTROLLER:U301.23 25.8,22 26.2,22.4 26.2,23.04 25.91,23.33 24.32,23.33 22.6,25.05 22.6,37.02 07_CONNECTORS:X706.2
UART1_RX  (via drill 0.2 pad 0.45)
  Top 0.2: v38.25,13.8 04_WIFI:U401.16
  Bottom 0.2: 03_MICROCONTROLLER:U301.9 34.07,13.8 v38.25,13.8
UART1_TX  (via drill 0.2 pad 0.45)
  Top 0.2: v36.25,14.36 04_WIFI:U401.15
  Bottom 0.2: 03_MICROCONTROLLER:U301.8 33.43,14.94 34.01,14.36 v36.25,14.36
WIFI_RST  (via drill 0.2 pad 0.45)
  Top 0.2: 04_WIFI:R401.2 33.45,29.4 36.94,29.4 04_WIFI:U401.1 38.25,25.85 37.9,25.5 v30.45,25.5
  Bottom 0.2: 03_MICROCONTROLLER:U301.30 v30.45,25.5